# EAGLE design Wash_Hand (EAGLE 9.6.2)

## Sheet 1 of 2
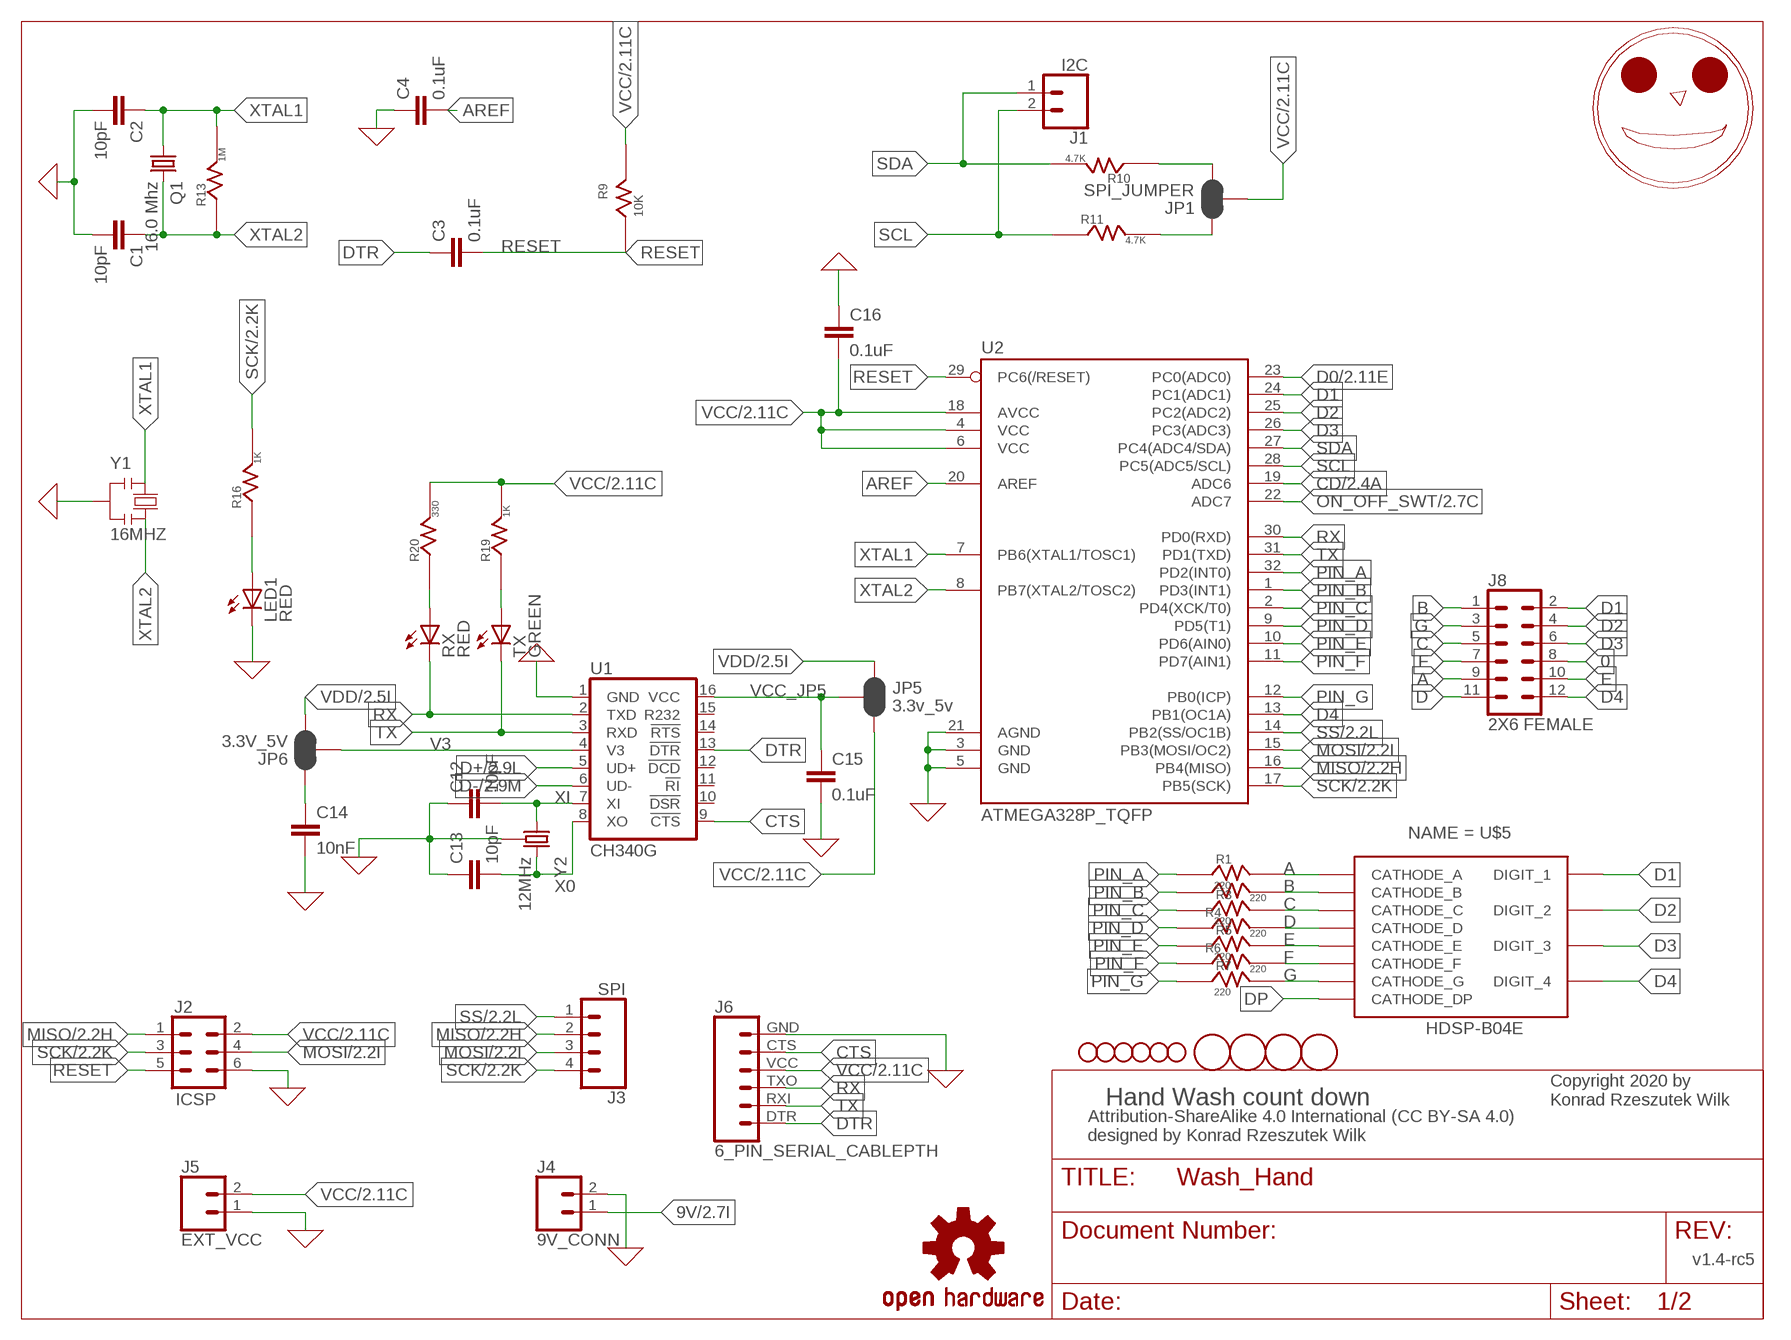
[diagram p0: schematic, sheet 1]
FRAME1 (LETTER_L): REVISION: v1.4-rc5

### Parts
C1  10pF  10UF-1206-6.3V-20%  [1206]
C2  10pF  10UF-1206-6.3V-20%  [1206]
C3  0.1uF  1.0UF-1206-50V-10%  [1206]
C4  0.1uF  1.0UF-1206-50V-10%  [1206]
C12  10pF  10UF-1206-6.3V-20%  [1206]
C13  10pF  10UF-1206-6.3V-20%  [1206]
C14  10nF  10UF-1206-6.3V-20%  [1206]
C15  0.1uF  10UF-1206-6.3V-20%  [1206]
C16  0.1uF  10UF-1206-6.3V-20%  [1206]
H1  STAND-OFF  [STAND-OFF]
H2  STAND-OFF  [STAND-OFF]
H3  STAND-OFF  [STAND-OFF]
H4  STAND-OFF  [STAND-OFF]
H5  STAND-OFF  [STAND-OFF]
H6  STAND-OFF  [STAND-OFF]
J1  I2C  CONN_02  [1X02]
J2  ICSP  CONN_03X2FEMALE  [2X3]
J3  SPI  CONN_04  [1X04]
J4  9V_CONN  CONN_02  [1X02]
J5  EXT_VCC  CONN_02  [1X02]
J6  6_PIN_SERIAL_CABLEPTH  [FTDI_BASIC]
J8  2X6 FEMALE  CONN_06X2PTH_FEMALE  [2X6]
JP1  SPI_JUMPER  JUMPER-SMT_3_2-NC_PASTE_SILK  [SMT-JUMPER_3_2-NC_PASTE_SILK]
JP5  3.3v_5v  JUMPER-SMT_3_2-NC_PASTE_SILK  [SMT-JUMPER_3_2-NC_PASTE_SILK]
JP6  3.3V_5V  JUMPER-SMT_3_2-NC_PASTE_SILK  [SMT-JUMPER_3_2-NC_PASTE_SILK]
LED1  RED  LEDSMT1206  [1206]
LOGO1  OSHW-LOGOM  [OSHW-LOGO-M]
LOGO2  HAPPY_FACE_LOGO  [HAPPY_FACE_LOGO]
Q1  16.0 Mhz  CRYSTALHC49S  [HC49/S]
R1  220  RESISTORR1206  [1206]
R2  220  RESISTORR1206  [1206]
R3  220  RESISTORR1206  [1206]
R4  220  RESISTORR1206  [1206]
R5  220  RESISTORR1206  [1206]
R6  220  RESISTORR1206  [1206]
R7  220  RESISTORR1206  [1206]
R9  10K  RESISTORR1206  [1206]
R10  4.7K  RESISTORR1206  [1206]
R11  4.7K  RESISTORR1206  [1206]
R13  1M  RESISTORR1206  [1206]
R16  1K  RESISTORR1206  [1206]
R19  1K  RESISTORR1206  [1206]
R20  330  RESISTORR1206  [1206]
RX  RED  LEDSMT1206  [1206]
TX  GREEN  LEDSMT1206  [1206]
U1  CH340G  CH340GSMD  [SO016]
U2  ATMEGA328P_TQFP  [TQFP32-08]
U$5  HDSP-B04E  [HDSP-B0XE]
U$7  FIDUCIAL  [FIDUCIAL_1MM]
U$8  FIDUCIAL  [FIDUCIAL_1MM]
U$9  FIDUCIAL  [FIDUCIAL_1MM]
U$10  FIDUCIAL  [FIDUCIAL_1MM]
Y1  16MHZ  RESONATORMU  [RESONATOR]
Y2  12MHz  CRYSTAL-GROUNDED3.2X2.5  [CRYSTAL-SMD-3.2X2.5]

### Nets
0: C1.2 C2.2 C4.1 C12.1 C13.1 C14.2 C15.2 C16.1 J2.6 J4.2 J5.1 J6.GND J8.8 LED1.C U1.1(GND) U2.3(GND) U2.5(GND) U2.21(AGND) Y1.2 Y2.2(GND) Y2.4(GND) ; supply symbol labelled GND ; also sheet 2
9V: J4.1 ; also sheet 2
A: J8.9 R1.2(R_2) U$5.PIN$11(CATHODE_A)
AREF: C4.2 U2.20(AREF)
B: J8.1 R2.2(R_2) U$5.PIN$7(CATHODE_B)
C: J8.5 R3.2(R_2) U$5.PIN$4(CATHODE_C)
CD: U2.19(ADC6) ; also sheet 2
CTS: J6.CTS U1.9(!CTS)
D: J8.11 R4.2(R_2) U$5.PIN$2(CATHODE_D)
D0: U2.23(PC0(ADC0)) ; also sheet 2
D1: J8.2 U2.24(PC1(ADC1)) U$5.PIN12(DIGIT_1)
D2: J8.4 U2.25(PC2(ADC2)) U$5.PIN$9(DIGIT_2)
D3: J8.6 U2.26(PC3(ADC3)) U$5.PIN$8(DIGIT_3)
D4: J8.12 U2.13(PB1(OC1A)) U$5.PIN$6(DIGIT_4)
D+: U1.5(UD+) ; also sheet 2
D-: U1.6(UD-) ; also sheet 2
DP: U$5.PIN$3(CATHODE_DP)
DTR: C3.1 J6.DTR U1.13(!DTR)
E: J8.10 R5.2(R_2) U$5.PIN$1(CATHODE_E)
F: J8.7 R6.2(R_2) U$5.PIN$10(CATHODE_F)
G: J8.3 R7.2(R_2) U$5.PIN$5(CATHODE_G)
MISO: J2.1 J3.2 U2.16(PB4(MISO)) ; also sheet 2
MOSI: J2.4 J3.3 U2.15(PB3(MOSI/OC2)) ; also sheet 2
N$5: JP1.3 R10.1(R_1)
N$6: JP1.1 R11.2(R_2)
N$7: LED1.A R16.1(R_1)
N$8: R19.1(R_1) TX.A
N$12: R20.1(R_1) RX.A
N$17: C14.1 JP6.1
ON_OFF_SWT: U2.22(ADC7) ; also sheet 2
PIN_A: R1.1(R_1) U2.32(PD2(INT0))
PIN_B: R2.1(R_1) U2.1(PD3(INT1))
PIN_C: R3.1(R_1) U2.2(PD4(XCK/T0))
PIN_D: R4.1(R_1) U2.9(PD5(T1))
PIN_E: R5.1(R_1) U2.10(PD6(AIN0))
PIN_F: R6.1(R_1) U2.11(PD7(AIN1))
PIN_G: R7.1(R_1) U2.12(PB0(ICP))
RESET: C3.2 J2.5 R9.1(R_1) U2.29(PC6(/RESET))
RX: J6.TXO RX.C U1.2(TXD) U2.30(PD0(RXD))
SCK: J2.3 J3.4 R16.2(R_2) U2.17(PB5(SCK)) ; also sheet 2
SCL: J1.2 R11.1(R_1) U2.28(PC5(ADC5/SCL))
SDA: J1.1 R10.2(R_2) U2.27(PC4(ADC4/SDA))
SS: J3.1 U2.14(PB2(SS/OC1B)) ; also sheet 2
TX: J6.RXI TX.C U1.3(RXD) U2.31(PD1(TXD))
V3: JP6.2 U1.4(V3)
VCC: C16.2 J2.2 J5.2 J6.VCC JP1.2 JP5.3 R9.2(R_2) R19.2(R_2) R20.2(R_2) U2.4(VCC) U2.6(VCC) U2.18(AVCC) ; also sheet 2
VCC_JP5: C15.1 JP5.2 U1.16(VCC)
VDD: JP5.1 JP6.3 ; also sheet 2
X0: C13.2 U1.8(XO) Y2.3
XI: C12.2 U1.7(XI) Y2.1
XTAL1: C2.1 Q1.1 R13.2(R_2) U2.7(PB6(XTAL1/TOSC1)) Y1.1
XTAL2: C1.1 Q1.2 R13.1(R_1) U2.8(PB7(XTAL2/TOSC2)) Y1.3
Unconnected: U1.10(!DSR) U1.11(!RI) U1.12(!DCD) U1.14(!RTS) U1.15(R232)

### Notes on the sheet
- Hand Wash count down
- Copyright 2020 by
  Konrad Rzeszutek Wilk
- Attribution-ShareAlike 4.0 International (CC BY-SA 4.0) 
  designed by Konrad Rzeszutek Wilk

## Sheet 2 of 2
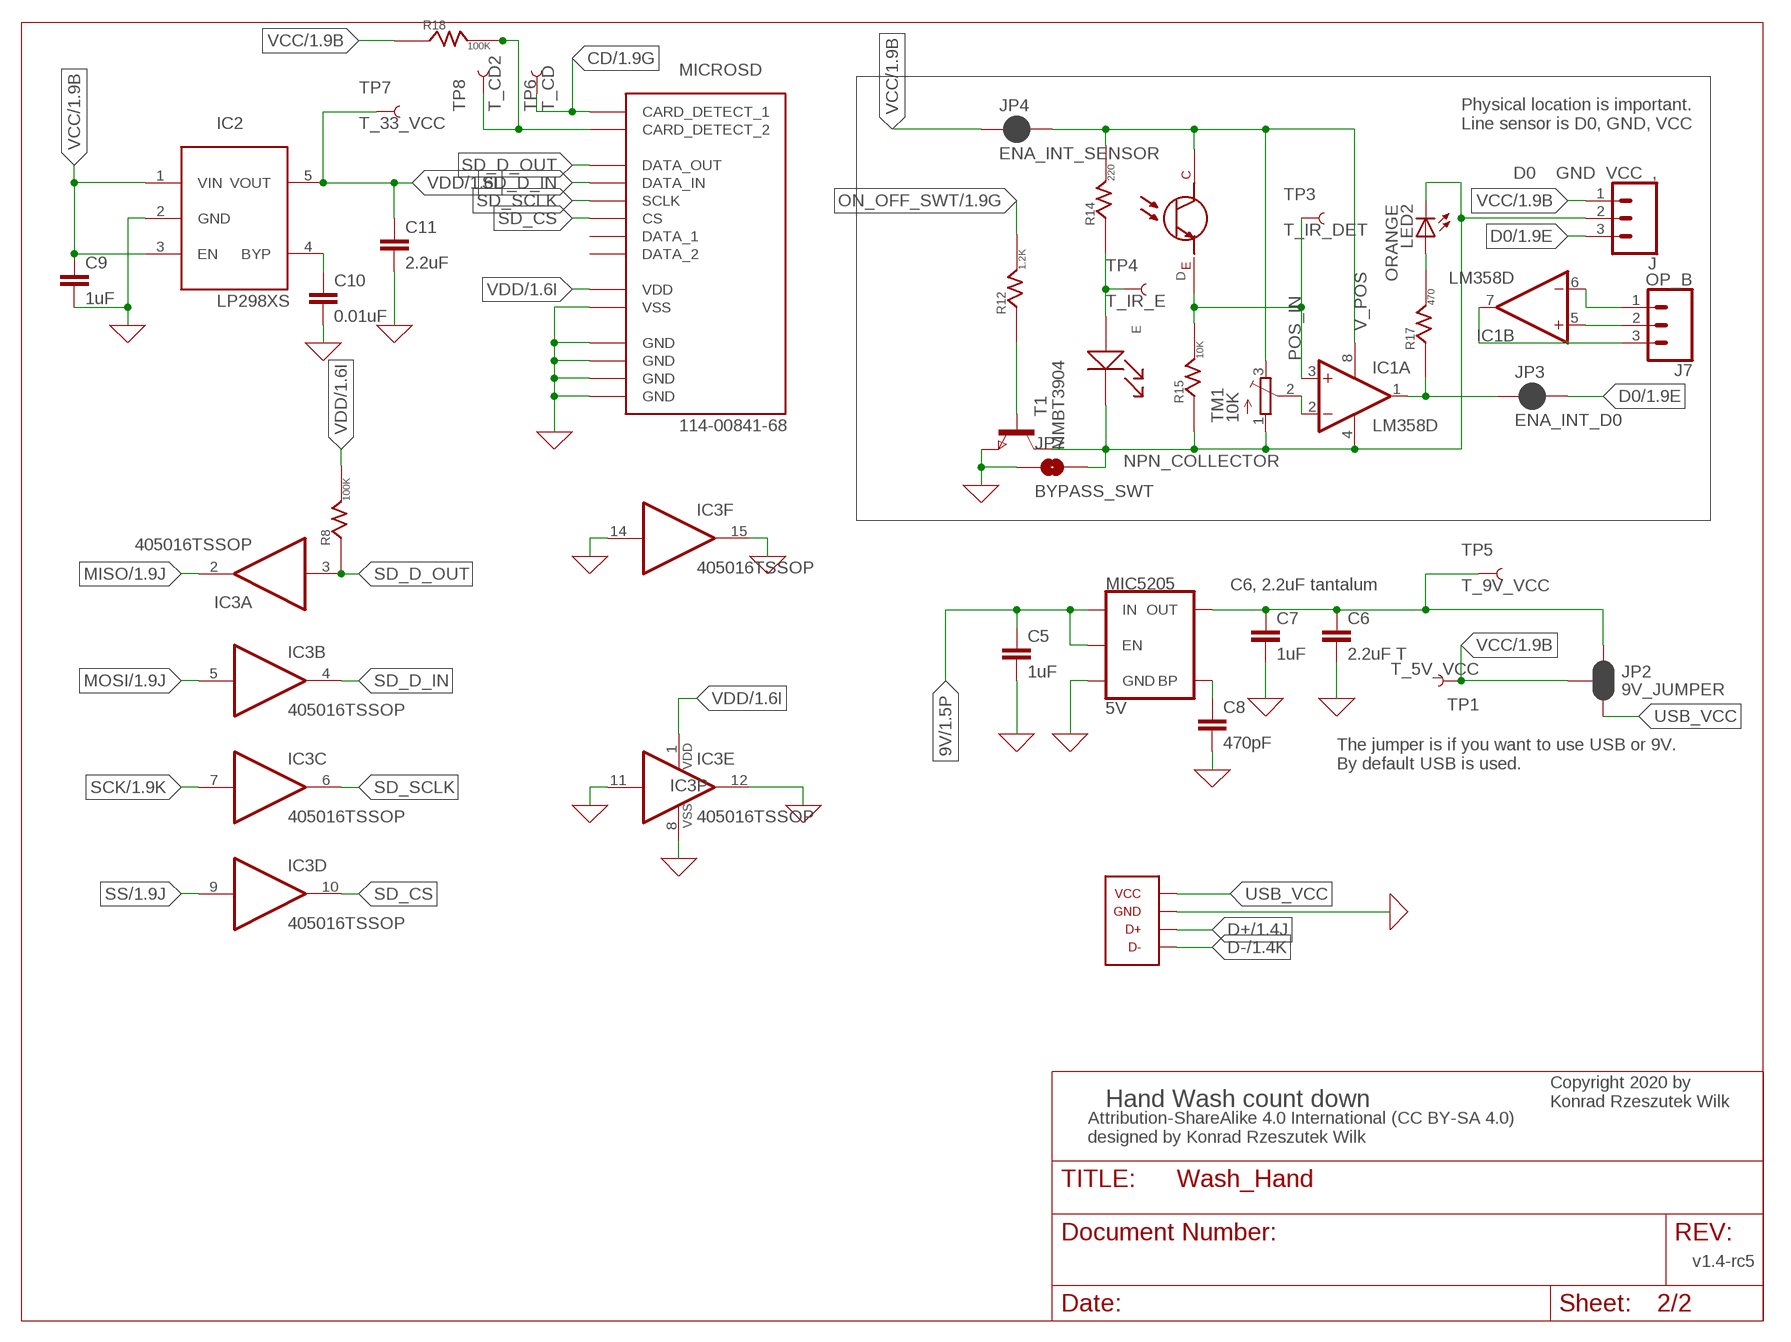
[diagram p1: schematic, sheet 2]
FRAME2 (LETTER_L): REVISION: v1.4-rc5

### Parts
C5  1uF  1.0UF-1206-50V-10%  [1206]
C6  2.2uF T  1.0UF-1206-50V-10%  [1206]
C7  1uF  1.0UF-1206-50V-10%  [1206]
C8  470pF  1.0UF-1206-50V-10%  [1206]
C9  1uF  1.0UF-1206-50V-10%  [1206]
C10  0.01uF  1.0UF-1206-50V-10%  [1206]
C11  2.2uF  1.0UF-1206-50V-10%  [1206]
D  LTR-301  [LTR-301]
E  LTE-302  [LTE-302]
IC1  LM358D  [SO08]
IC2  LP298XS  [SOT23-5L]
IC3  405016TSSOP  [TSSOP16]
J  D0 GND VCC ,  CONN_03  [1X03]
J7  OP_B  CONN_03  [1X03]
JP2  9V_JUMPER  JUMPER-SMT_3_2-NC_PASTE_SILK  [SMT-JUMPER_3_2-NC_PASTE_SILK]
JP3  ENA_INT_D0  JUMPER-SMT_2_NC_PASTE_SILK  [SMT-JUMPER_2_NC_PASTE_SILK]
JP4  ENA_INT_SENSOR  JUMPER-SMT_2_NC_PASTE_SILK  [SMT-JUMPER_2_NC_PASTE_SILK]
JP7  BYPASS_SWT  JUMPER-SMT_2_NO_SILK  [SMT-JUMPER_2_NO_SILK]
LED2  ORANGE  LEDSMT1206  [1206]
MIC5205  5V  V_REG_MIC52055V  [SOT23-5]
MICROSD  114-00841-68  [114-00841-68]
R8  100K  RESISTORR1206  [1206]
R12  1.2K  RESISTORR1206  [1206]
R14  220  RESISTORR1206  [1206]
R15  10K  RESISTORR1206  [1206]
R17  470  RESISTORR1206  [1206]
R18  100K  RESISTORR1206  [1206]
T1  MMBT3904  NPNSOT23  [SOT-23]
TM1  10K  TRIMPOTTC33X  [TC33X]
TP1  T_5V_VCC  TEST-POINT3X4  [PAD.03X.04]
TP3  T_IR_DET  TEST-POINT3X4  [PAD.03X.04]
TP4  T_IR_E  TEST-POINT3X4  [PAD.03X.04]
TP5  T_9V_VCC  TEST-POINT3X4  [PAD.03X.04]
TP6  T_CD  TEST-POINT3X4  [PAD.03X.04]
TP7  T_33_VCC  TEST-POINT3X4  [PAD.03X.04]
TP8  T_CD2  TEST-POINT3X4  [PAD.03X.04]
U$4  USB_MICROB_10118194_AMPHENOL  [USB_MICROB_10118194_AMPHENOL]

### Nets
0: C5.2 C6.2 C7.2 C8.2 C9.2 C10.2 C11.2 IC2.2(GND) IC3.8(P:VSS) IC3.11(E:I) IC3.12(E:O) IC3.14(F:I) IC3.15(F:O) JP7.1 MIC5205.2(GND) MICROSD.GND$1(GND) MICROSD.GND$2(GND) MICROSD.GND$3(GND) MICROSD.GND$4(GND) MICROSD.VSS T1.2(E) U$4.5(GND) ; supply symbol labelled GND ; also sheet 1
9V: C5.1 MIC5205.1(IN) MIC5205.3(EN) ; also sheet 1
CD: MICROSD.CD_SW_1(CARD_DETECT_1) TP6.P$1 ; also sheet 1
D0: IC1.1(A:OUT) J.3 JP3.1 JP3.2 R17.1(R_1) ; also sheet 1
D+: U$4.3(D+) ; also sheet 1
D-: U$4.2(D-) ; also sheet 1
MISO: IC3.2(A:O) ; also sheet 1
MOSI: IC3.5(B:I) ; also sheet 1
N$1: IC1.7(B:OUT) J7.3
N$2: MICROSD.CD_SW_2(CARD_DETECT_2) R18.2(R_2) TP8.P$1
N$9: IC1.5(B:+IN) J7.2
N$10: C6.1 C7.1 JP2.1 MIC5205.5(OUT) TP5.P$1
N$11: E.A(A$1) R14.1(R_1) TP4.P$1
N$13: C10.1 IC2.4(BYP)
N$14: IC1.6(B:-IN) J7.1
N$15: LED2.A R17.2(R_2)
N$16: R12.1(R_1) T1.3(B)
N$18: C8.1 MIC5205.4(BP)
NEG_IN: IC1.2(A:-IN) TM1.2(S)
NPN_COLLECTOR: E.C(K$1) IC1.4(P:V-) J.2 JP7.2 LED2.C R15.1(R_1) T1.1(C) TM1.1(A)
ON_OFF_SWT: R12.2(R_2) ; also sheet 1
POS_IN: D.E(E$1) IC1.3(A:+IN) R15.2(R_2) TP3.P$1
SCK: IC3.7(C:I) ; also sheet 1
SD_CS: IC3.10(D:O) MICROSD.CS
SD_D_IN: IC3.4(B:O) MICROSD.DATA_IN
SD_D_OUT: IC3.3(A:I) MICROSD.DATA_OUT R8.1(R_1)
SD_SCLK: IC3.6(C:O) MICROSD.SCLK
SS: IC3.9(D:I) ; also sheet 1
USB_VCC: JP2.3 U$4.1(VCC)
V_POS: D.C(C$1) IC1.8(P:V+) JP4.2 R14.2(R_2) TM1.3(E)
VCC: C9.1 IC2.1(VIN) IC2.3(EN) J.1 JP2.2 JP4.1 R18.1(R_1) TP1.P$1 ; also sheet 1
VDD: C11.1 IC2.5(VOUT) IC3.1(P:VDD) MICROSD.VDD R8.2(R_2) TP7.P$1 ; also sheet 1
Unconnected: MICROSD.DATA_1 MICROSD.DATA_2

### Notes on the sheet
- Physical location is important.
  Line sensor is D0, GND, VCC
- C6, 2.2uF tantalum
- The jumper is if you want to use USB or 9V.
  By default USB is used.
- Hand Wash count down
- Copyright 2020 by
  Konrad Rzeszutek Wilk
- Attribution-ShareAlike 4.0 International (CC BY-SA 4.0) 
  designed by Konrad Rzeszutek Wilk

## Library data of the parts
C1 C2 C12-C16 = SparkFun-Capacitors:10UF: 10.0µF ceramic capacitors A capacitor is a passive two-terminal electrical component used to store electrical energy temporarily in an electric field.; PROD_ID: CAP-10057; VALUE: 10uF
C3-C11 = SparkFun-Capacitors:1.0UF: 1µF ceramic capacitors A capacitor is a passive two-terminal electrical component used to store electrical energy temporarily in an electric field.; PROD_ID: CAP-09822; VALUE: 1.0uF
D = darnok_sensors:LTR-301
E = darnok_sensors:LTE-302
H1-H6 = SparkFun-Hardware:STAND-OFF: Stand Off Drill holes for mechanically mounting via screws, standoffs, etc. Note: Use the keepout ring to avoid running the screw head into surrounding components. Variant Overviews STAND-OFF - Mechanical footprint for a #4 phillips button head screw. STAND-OFF-TIGHT - Mechanical footprint for a #4 phillips button head screw, Example SparkFun Products Screw - Phillips Head (1/4", 4-40, 10 pack) <https://www.sparkfun.com/products/10453> (PRT-10453) Screw - Phillips Head (1/2", 4-40, 10 pack) <https://www.sparkfun.com/products/10452> (PRT-10452) Screw - Phillips Head (3/4", 4-40, 10 pack) <https://www.sparkfun.com/products/10451> (PRT-10451) Screw - Phillips Head (1", 4-40, 10 pack) <https://www.sparkfun.com/products/10450> (PRT-10450)
IC1 = linear:LM358: OP AMP also LM158; LM258; LM2904 Source: http://cache.national.com/ds/LM/LM158.pdf
IC2 = adafruit:LP298X
IC3 = darnok_4050:4050: Hex non-inverting BUFFER aka CD74HC4050PWR
J J7 = SparkFun-Connectors:CONN_03: Multi connection point. Often used as Generic Header-pin footprint for 0.1 inch spaced/style header connections On any of the 0.1 inch spaced packages, you can populate with these: Break Away Headers - Straight <https://www.sparkfun.com/products/116> (PRT-00116) Break Away Male Headers - Right Angle <https://www.sparkfun.com/products/553> (PRT-00553) Female Headers <https://www.sparkfun.com/products/115> (PRT-00115) Break Away Headers - Machine Pin <https://www.sparkfun.com/products/117> (PRT-00117) Break Away Female Headers - Swiss Machine Pin <https://www.sparkfun.com/products/743> (PRT-00743) Stackable Header - 3 Pin (Female, 0.1") <https://www.sparkfun.com/products/13875> (PRT-13875) For SCREWTERMINALS and SPRING TERMINALS visit here: Screw Terimnals on SparkFun.com <https://www.sparkfun.com/search/results?term=Screw+Terminals> (5mm/3.5mm/2.54mm spacing) This device is also useful as a general connection point to wire up your design to another part of your project. Our various solder wires solder well into these plated through hole pads. Hook-Up Wire - Assortment (Stranded, 22 AWG) <https://www.sparkfun.com/products/11375> (PRT-11375) Hook-Up Wire - Assortment (Solid Core, 22 AWG) <https://www.sparkfun.com/products/11367> (PRT-11367) View the entire wire category on our website here <https://www.sparkfun.com/categories/141> Special notes: Molex polarized connector foot print use with SKU : PRT-08232 with associated crimp pins and housings.
J1 J4 J5 = SparkFun-Connectors:CONN_02: Multi connection point. Often used as Generic Header-pin footprint for 0.1 inch spaced/style header connections On any of the 0.1 inch spaced packages, you can populate with these: Break Away Headers - Straight <https://www.sparkfun.com/products/116> (PRT-00116) Break Away Male Headers - Right Angle <https://www.sparkfun.com/products/553> (PRT-00553) Female Headers <https://www.sparkfun.com/products/115> (PRT-00115) Break Away Headers - Machine Pin <https://www.sparkfun.com/products/117> (PRT-00117) Break Away Female Headers - Swiss Machine Pin <https://www.sparkfun.com/products/743> (PRT-00743) For SCREWTERMINALS and SPRING TERMINALS visit here: Screw Terimnals on SparkFun.com <https://www.sparkfun.com/search/results?term=Screw+Terminals> (5mm/3.5mm/2.54mm spacing) This device is also useful as a general connection point to wire up your design to another part of your project. Our various solder wires solder well into these plated through hole pads. Hook-Up Wire - Assortment (Stranded, 22 AWG) <https://www.sparkfun.com/products/11375> (PRT-11375) Hook-Up Wire - Assortment (Solid Core, 22 AWG) <https://www.sparkfun.com/products/11367> (PRT-11367) View the entire wire category on our website here <https://www.sparkfun.com/categories/141> Special notes: Molex polarized connector foot print use with: PRT-08233 with associated crimp pins and housings. 2.54_SCREWTERM for use with PRT-10571. 3.5mm Screw Terminal footprints for PRT-08084 5mm Screw Terminal footprints for use with PRT-08432
J2 = SparkFun-Connectors:CONN_03X2: Multi connection point. Often used as Generic Header-pin footprint for 0.1 inch spaced/style header connections You can populate with any combo of single row headers, but if you'd like an exact match, check these: Header - 2x3 (Male, 0.1") <https://www.sparkfun.com/products/12807> (PRT-12807) Header - 2x3 (Female, 0.1") <https://www.sparkfun.com/products/13010> (PRT-13010) 2x3 Pin Shrouded Header <https://www.sparkfun.com/products/10877> (PRT-10877) On any of the 0.1 inch spaced packages, you can populate with these: Break Away Headers - Straight <https://www.sparkfun.com/products/116> (PRT-00116) Break Away Male Headers - Right Angle <https://www.sparkfun.com/products/553> (PRT-00553) Female Headers <https://www.sparkfun.com/products/115> (PRT-00115) Break Away Headers - Machine Pin <https://www.sparkfun.com/products/117> (PRT-00117) Break Away Female Headers - Swiss Machine Pin <https://www.sparkfun.com/products/743> (PRT-00743) Special note: the shrouded connector mates well with our 3x2 ribbon cables: Ribbon Crimp Connector - 6-pin (2x3, Female) <https://www.sparkfun.com/products/10651> (PRT-10651) Ribbon Cable - 6 wire (15ft) <https://www.sparkfun.com/products/10646> (PRT-10646); PROD_ID: CONN-11566; VALUE: FEMALE 2x3
J3 = SparkFun-Connectors:CONN_04: Multi connection point. Often used as Generic Header-pin footprint for 0.1 inch spaced/style header connections On any of the 0.1 inch spaced packages, you can populate with these: Break Away Headers - Straight <https://www.sparkfun.com/products/116> (PRT-00116) Break Away Male Headers - Right Angle <https://www.sparkfun.com/products/553> (PRT-00553) Female Headers <https://www.sparkfun.com/products/115> (PRT-00115) Break Away Headers - Machine Pin <https://www.sparkfun.com/products/117> (PRT-00117) Break Away Female Headers - Swiss Machine Pin <https://www.sparkfun.com/products/743> (PRT-00743) For SCREWTERMINALS and SPRING TERMINALS visit here: Screw Terimnals on SparkFun.com <https://www.sparkfun.com/search/results?term=Screw+Terminals> (5mm/3.5mm/2.54mm spacing) This device is also useful as a general connection point to wire up your design to another part of your project. Our various solder wires solder well into these plated through hole pads. Hook-Up Wire - Assortment (Stranded, 22 AWG) <https://www.sparkfun.com/products/11375> (PRT-11375) Hook-Up Wire - Assortment (Solid Core, 22 AWG) <https://www.sparkfun.com/products/11367> (PRT-11367) View the entire wire category on our website here <https://www.sparkfun.com/categories/141> Special notes: Molex polarized connector foot print use with SKU : PRT-08231 with associated crimp pins and housings. 1MM SMD Version SKU: PRT-10208; PROD_ID: CONN-09696
J6 = SparkFun-Connectors:6_PIN_SERIAL_CABLE: 6-pin header connection for use with the "FTDI BASIC" pinout - CABLE SIDE. Also known as "Arduino Serial Program Header". This is used on a design to provide a 6-pin connection point for serial communication usually from a USB cable (D+/D-) to these headers (RX/TX). It also has the remaining pins necessary for programming in the Arduino evironment (DTR, GND, and sometimes VCC). Note, this device has "CABLE" in the name. It is intended to be used on a design that usually lives on the end of your USB cable and prvides the converter chip (FTDI232 or FTDI231x) to commnicate serial RX/TX. The "sister" device, named "TARGET" is inteneded to be used on a design that contains a target micro-controller that you wish to program. You can populate with some of these: Female Headers <https://www.sparkfun.com/products/115> (PRT-00115) For reference (or to suit your programming needs) check out these designs: SparkFun FTDI Basic Breakout - 5V <https://www.sparkfun.com/products/9716> (DEV-09716) SparkFun FTDI Basic Breakout - 3.3V <https://www.sparkfun.com/products/9873> (DEV-09873) SparkFun FTDI SmartBasic <https://www.sparkfun.com/products/12935> (DEV-12935) SparkFun Beefy 3 - FTDI Basic Breakout <https://www.sparkfun.com/products/13746> (DEV-13746)
J8 = SparkFun-Connectors:CONN_06X2: Multi connection point. Often used as Generic Header-pin footprint for 0.1 inch spaced/style header connections On any of the 0.1 inch spaced packages, you can populate with these: Break Away Headers - Straight <https://www.sparkfun.com/products/116> (PRT-00116) Break Away Male Headers - Right Angle <https://www.sparkfun.com/products/553> (PRT-00553) Female Headers <https://www.sparkfun.com/products/115> (PRT-00115) Break Away Headers - Machine Pin <https://www.sparkfun.com/products/117> (PRT-00117) Break Away Female Headers - Swiss Machine Pin <https://www.sparkfun.com/products/743> (PRT-00743); PROD_ID: CONN-12423
JP1 JP2 JP5 JP6 = SparkFun-Jumpers:JUMPER-SMT_3_2-NC_PASTE: Normally closed solder jumper (2 of 2 connections) This jumper has an aperture in the stencil to allow solder paste to bridge both connections. Both connections are normally closed (NC). Wick off the solder to open the connection(s). Reapply solder to reclose the connection(s).
JP3 JP4 = SparkFun-Jumpers:JUMPER-SMT_2_NC_PASTE: Normally closed solder jumper This jumper has an aperture in the stencil to allow solder paste to bridge the split in the wire so it's normally closed (NC). Wick off the solder to open the connection. Reapply solder to reclose the connection.
JP7 = SparkFun-Jumpers:JUMPER-SMT_2_NO: Normally open jumper This jumper has two pads in close proximity to each other. Apply solder to close the connection. Round pads are easier to solder for beginners, but are a lot larger. SparkFun Product that uses the round pads: SparkFun EL Sequencer <https://www.sparkfun.com/products/12781>
LED1 LED2 RX TX = adafruit:LED: LED OSRAM: - CHIPLED LG R971, LG N971, LY N971, LG Q971, LY Q971, LO R971, LY R971 LH N974, LH R974 LS Q976, LO Q976, LY Q976 LO Q996 - Hyper CHIPLED LW Q18S LB Q993, LB Q99A, LB R99A - SideLED LS A670, LO A670, LY A670, LG A670, LP A670 LB A673, LV A673, LT A673, LW A673 LH A674 LY A675 LS A676, LA A676, LO A676, LY A676, LW A676 LS A679, LY A679, LG A679 - Hyper Micro SIDELED® LS Y876, LA Y876, LO Y876, LY Y876 LT Y87S - SmartLED LW L88C, LW L88S LB L89C, LB L89S, LG L890 LS L89K, LO L89K, LY L89K LS L896, LA L896, LO L896, LY L896 - TOPLED LS T670, LO T670, LY T670, LG T670, LP T670 LSG T670, LSP T670, LSY T670, LOP T670, LYG T670 LG T671, LOG T671, LSG T671 LB T673, LV T673, LT T673, LW T673 LH T674 LS T676, LA T676, LO T676, LY T676, LB T676, LH T676, LSB T676, LW T676 LB T67C, LV T67C, LT T67C, LS T67K, LO T67K, LY T67K, LW E67C LS E67B, LA E67B, LO E67B, LY E67B, LB E67C, LV E67C, LT E67C LW T67C LS T679, LY T679, LG T679 LS T770, LO T770, LY T770, LG T770, LP T770 LB T773, LV T773, LT T773, LW T773 LH T774 LS E675, LA E675, LY E675, LS T675 LS T776, LA T776, LO T776, LY T776, LB T776 LHGB T686 LT T68C, LB T68C - Hyper Mini TOPLED® LB M676 - Mini TOPLED Santana® LG M470 LS M47K, LO M47K, LY M47K Source: http://www.osram.convergy.de/
LOGO1 = SparkFun-Aesthetics:OSHW-LOGO: Open-Source Hardware (OSHW) Logo This logo indicates the piece of hardware it is found on incorporates a OSHW license and/or adheres to the definition of open source hardware found here: http://freedomdefined.org/OSHW
LOGO2 = darnok_logo:HAPPY_FACE_LOGO
MIC5205 = SparkFun-IC-Power:V_REG_MIC5205: V_REG MIC5205 Standard 3.3V, 5V, and Adjustable 150mA LDO voltage regulator in SOT-23 layout. Micrel part MIC5205. BP (by-pass) pin is used to lower output noise with 470pF cap, may be left open. On the adjustable version BP is used to set output.; PROD_ID: VREG-00823
MICROSD = darnok_microsd:114-00841-68: Amphenol MicroSD Push Pull Data sheet is available at here <https://media.digikey.com/pdf/Data%20Sheets/Amphenol%20PDFs/114-00841-68.pdf>.
Q1 = adafruit:CRYSTAL: CRYSTAL; OC_FARNELL: 1667008; OC_NEWARK: unknown
R1-R20 = darnok_common:RESISTOR
T1 = zetex:NPNSOT23: NPN TRANSISTOR; MPN: DSS20201L-7; OC_FARNELL: 1710688; OC_NEWARK: 25R4555
TM1 = adafruit:TRIMPOT: SMT trimmer potentiometer part number TC33X http://www.ladyada.net/library/eagle
TP1 TP3-TP8 = SparkFun-Connectors:TEST-POINT: SparkFun Test Points Bare copper test points for troubleshooting or In-Circuit-Testing. These are used by our Production team for verifying production board runs using pogo-pins on test beds. SparkFun Products: SparkFun LSM9DS1 Breakout <https://www.sparkfun.com/products/13284> SparkFun PSOC <https://www.sparkfun.com/products/13714> SparkFun Load Cell Amplifier <https://www.sparkfun.com/products/13879>
U1 = Serial-Basic:CH340G: A simple USB 2.0 to Serial IC.; PROD_ID: IC-13498
U2 = SparkFun-IC-Microcontroller:ATMEGA328P_TQFP: Popular 328P in QFP Storefront component: ATmega328 - TQFP <https://www.sparkfun.com/products/13448> (COM-13448) Datasheet <http://www.sparkfun.com/datasheets/Components/SMD/ATMega328.pdf> SparkFun Products SparkFun RedBoard - Programmed with Arduino <https://www.sparkfun.com/products/12757> (DEV-12757) Arduino Pro Mini 328 - 5V/16MHz <https://www.sparkfun.com/products/11113> (DEV-11113) Arduino Pro Mini 328 - 3.3V/8MHz <https://www.sparkfun.com/products/11114> (DEV-11114) SparkFun OpenLog <https://www.sparkfun.com/products/13712> (DEV-13712) SparkFun MicroView - OLED Arduino Module <https://www.sparkfun.com/products/12923> (DEV-12923) SparkFun Digital Sandbox <https://www.sparkfun.com/products/12651> (DEV-12651) SparkFun PicoBoard <https://www.sparkfun.com/products/11888> (WIG-11888) Arduino Fio <https://www.sparkfun.com/products/10116> (DEV-10116) LilyPad Arduino 328 Main Board <https://www.sparkfun.com/products/13342> (DEV-13342) SparkFun RedStick <https://www.sparkfun.com/products/13741> (DEV-13741) LilyPad MP3 <https://www.sparkfun.com/products/11013> (DEV-11013) LilyPad Arduino SimpleSnap <https://www.sparkfun.com/products/10941> (DEV-10941) SparkFun Stepoko <https://www.sparkfun.com/products/13899> (ROB-13899) SparkFun Geiger Counter <https://www.sparkfun.com/products/11345> (SEN-11345) SparkFun EL Sequencer <https://www.sparkfun.com/products/12781> (COM-12781) Arduino Pro 328 - 5V/16MHz <https://www.sparkfun.com/products/10915> (DEV-10915) CryptoCape <https://www.sparkfun.com/products/12773> (DEV-12773) SparkFun IR Thermometer Evaluation Board - MLX90614 <https://www.sparkfun.com/products/10740> (SEN-10740) SparkFun RedBot Mainboard <https://www.sparkfun.com/products/12097> (ROB-12097) Arduino Pro 328 - 3.3V/8MHz <https://www.sparkfun.com/products/10914> (DEV-10914) SparkFun Block for Intel® Edison - Arduino <https://www.sparkfun.com/products/13036> (DEV-13036) SparkFun Simon Says - Surface Mount Soldering Kit <https://www.sparkfun.com/products/10935> (KIT-10935) SparkFun 7-Segment Serial Display - Red <https://www.sparkfun.com/products/11441> (COM-11441) SparkFun 7-Segment Serial Display - White <https://www.sparkfun.com/products/11629> (COM-11629) SparkFun 7-Segment Serial Display - Yellow <https://www.sparkfun.com/products/11443> (COM-11443) SparkFun 7-Segment Serial Display - Kelly Green <https://www.sparkfun.com/products/11440> (COM-11440) SparkFun 7-Segment Serial Display - Blue <https://www.sparkfun.com/products/11442> (COM-11442) SparkFun OpenSegment Serial Display - 20mm (Blue) <https://www.sparkfun.com/products/11647> (COM-11647) SparkFun OpenSegment Serial Display - 20mm (Green) <https://www.sparkfun.com/products/11646> (COM-11646) SparkFun OpenSegment Serial Display - 20mm (White) <https://www.sparkfun.com/products/11648> (COM-11648) SparkFun OpenSegment Serial Display - 20mm (Red) <https://www.sparkfun.com/products/11644> (COM-11644) SparkFun OpenSegment Serial Display - 20mm (Yellow) <https://www.sparkfun.com/products/11645> (COM-11645) SparkFun OpenSegment Shield <https://www.sparkfun.com/products/13190> (DEV-13190); PROD_ID: IC-09069
U$4 = darnok_usb:USB_MICROB_10118194_AMPHENOL
U$5 = darnok_led:HDSP-B04E: 7 Segment LED light 0.56"
U$7-U$10 = adafruit:FIDUCIAL: For use by pick and place machines to calibrate the vision/machine, 1mm By microbuilder.eu
Y1 = darnok_common:RESONATOR
Y2 = Serial-Basic:CRYSTAL-GROUNDED: Small, 3.2x2.5mm, SMD Crystal; PROD_ID: XTAL-13518

## Board
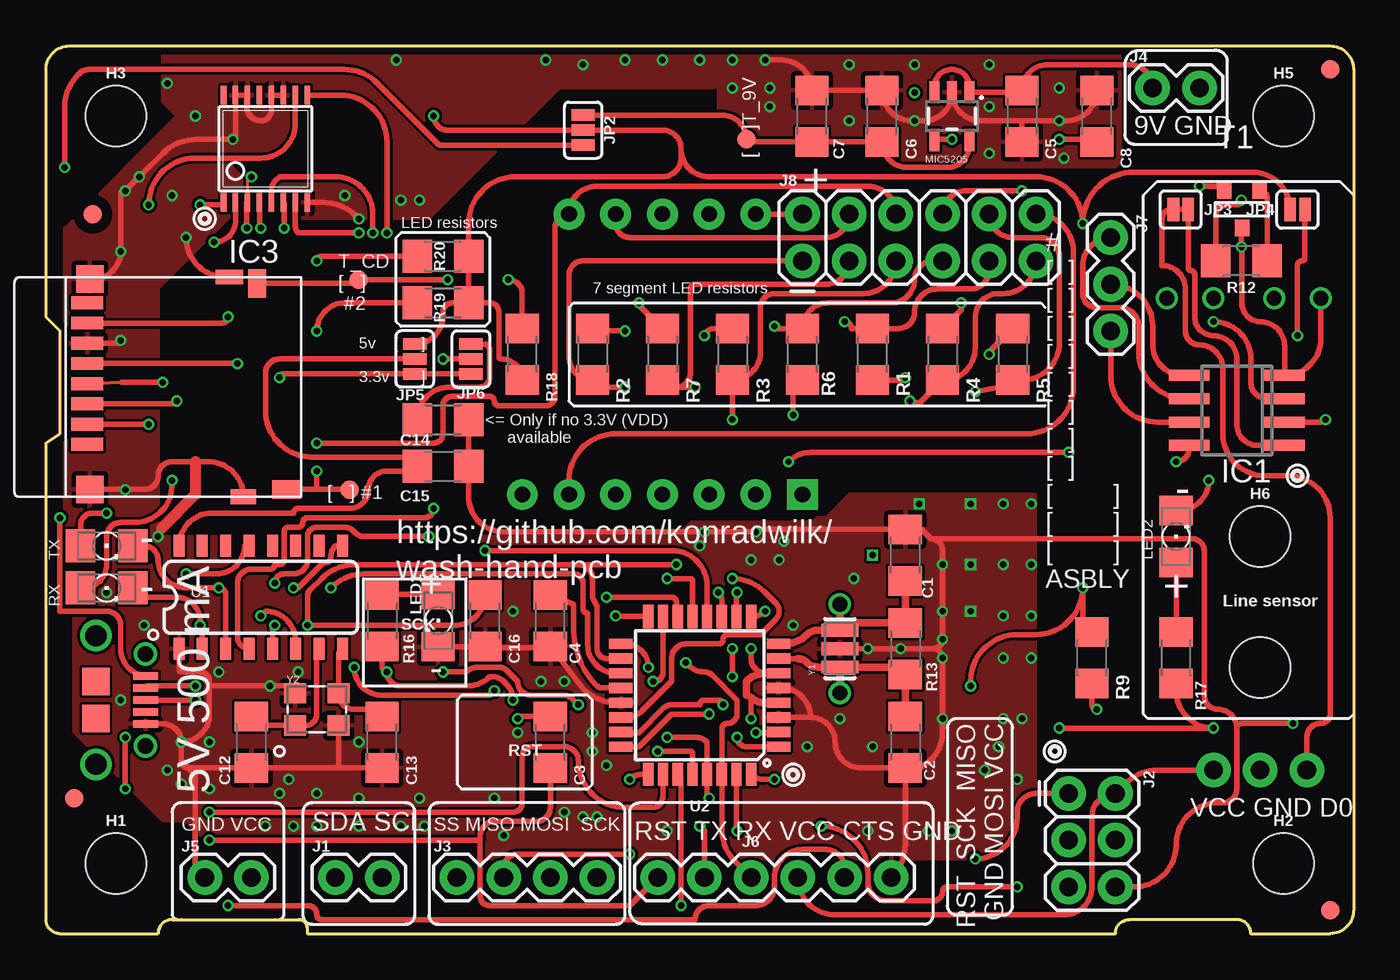
[diagram p2: board, top side]
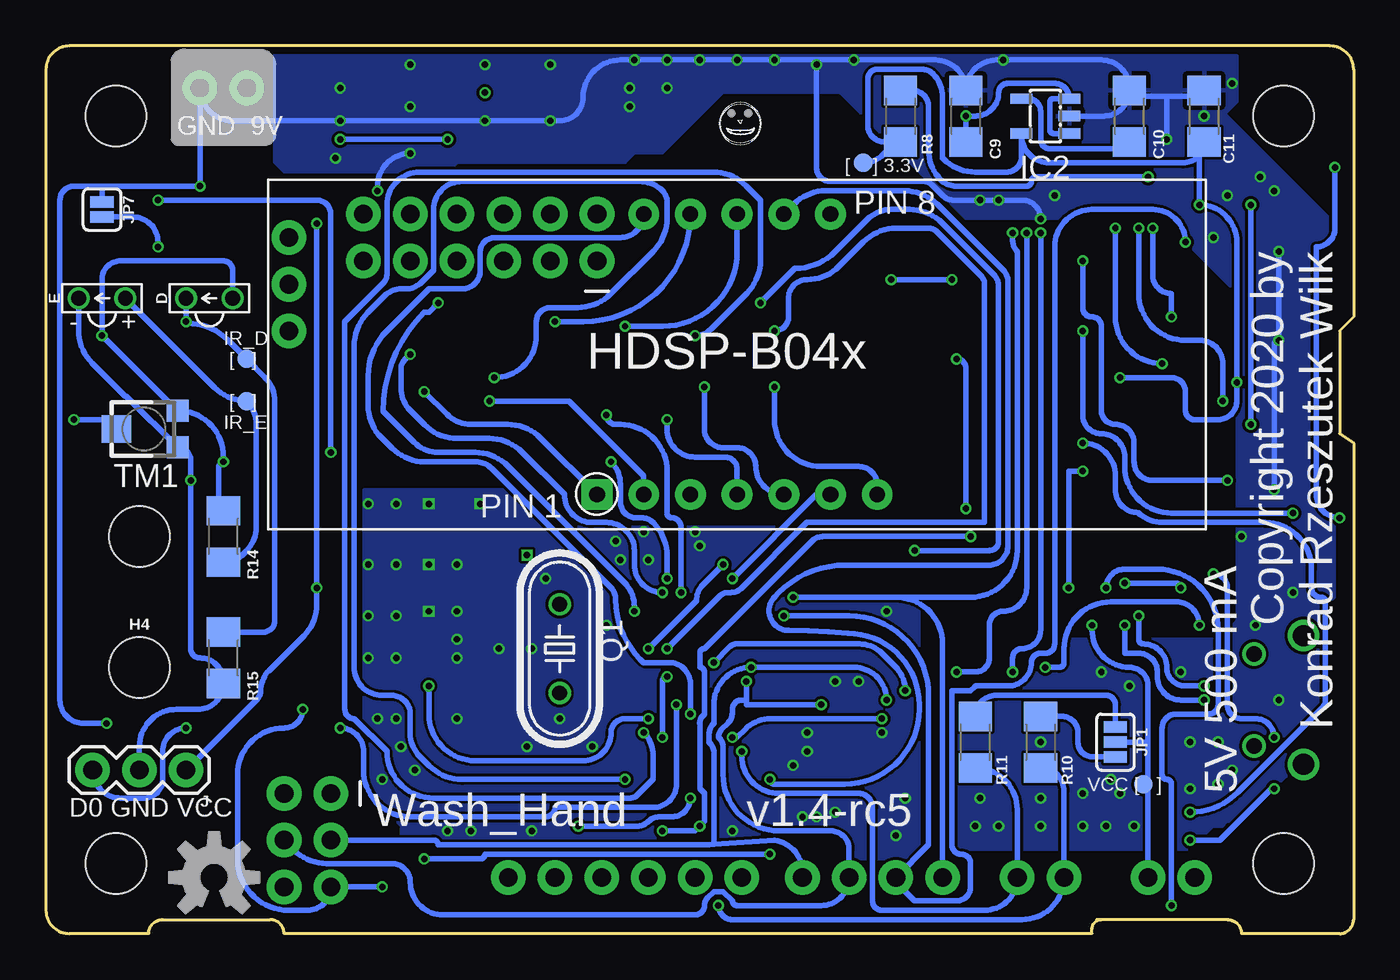
[diagram p3: board, bottom side, seen from below]

Size 71.12 x 48.26 mm. Coordinates in mm from the lower left corner, seen from the top.
Outline: 13.72,0.76 6.86,0.76 arc90 6.1,0 0.76,0 arc-90 0,0.76 0,26.67 0.76,27.18 0.76,32.77 0,33.53 0,46.99 arc-90 1.27,48.26 69.85,48.26 arc-90 71.12,46.99 71.12,1.27 arc-90 69.85,0 65.53,0 arc90 64.77,0.76 58.93,0.76 arc90 58.17,0 14.22,0 14.22,0.25 arc90 13.72,0.76
Outline: 13.72,0.76 13.97,0.76
Copper layers (1*16): Top 0.035559375mm / dielectric 1.6mm / Bottom 0.035559375mm
Design rules "oshpark-2layer": minimum track width 6mil, minimum drill 10mil, track to track 6mil, track to pad 6mil, pad to pad 6mil, via to via 6mil, smd to smd 6mil, copper to edge 15mil, drill to drill 6mil, minimum pad ring 5mil, minimum via ring 5mil, stop-mask expansion 2.5mil, vias tented up to drill 0mil, thermal gap 10mil

### Footprints (pad centres in the part's own frame; a part is rotated, then mirrored left to right if it is on the bottom)
1206 = smd 1.6 x 1.8: 1 -1.4,0; 2 1.4,0
LTR-301 = drill 0.8: C 1.27,0; E -1.27,0
LTE-302 = drill 0.8: A 1.27,0; C -1.27,0
STAND-OFF = hole 3.302: 0,0
SO08 = smd 0.6 x 2.2: 1 -1.905,-2.6; 2 -0.635,-2.6; 3 0.635,-2.6; 4 1.905,-2.6; 5 1.905,2.6; 6 0.635,2.6; 7 -0.635,2.6; 8 -1.905,2.6
SOT23-5L = smd 0.55 x 1.2: 1 -0.95,-1.3; 2 0,-1.3; 3 0.95,-1.3; 4 0.95,1.3; 5 -0.95,1.3
TSSOP16 = smd 0.305 x 0.991: 1 -2.275,-2.918; 2 -1.625,-2.918; 3 -0.975,-2.918; 4 -0.325,-2.918; 5 0.325,-2.918; 6 0.975,-2.918; 7 1.625,-2.918; 8 2.275,-2.918; 9 2.275,2.918; 10 1.625,2.918; 11 0.975,2.918; 12 0.325,2.918; 13 -0.325,2.918; 14 -0.975,2.918; 15 -1.625,2.918; 16 -2.275,2.918
1X03 = drill 1.016 pad 1.88: 1 0,0; 2 2.54,0; 3 5.08,0
1X02 = drill 1.016 pad 1.88: 1 0,0; 2 2.54,0
2X3 = drill 1.016 pad 1.88: 1 0,0; 2 0,2.54; 3 2.54,0; 4 2.54,2.54; 5 5.08,0; 6 5.08,2.54
1X04 = drill 1.016 pad 1.88: 1 0,0; 2 2.54,0; 3 5.08,0; 4 7.62,0
FTDI_BASIC = drill 1.016 pad 1.88: CTS 10.16,0; DTR 0,0; GND 12.7,0; RXI 2.54,0; TXO 5.08,0; VCC 7.62,0
2X6 = drill 1.016 pad 1.88: 1 0,0; 2 0,2.54; 3 2.54,0; 4 2.54,2.54; 5 5.08,0; 6 5.08,2.54; 7 7.62,0; 8 7.62,2.54; 9 10.16,0; 10 10.16,2.54; 11 12.7,0; 12 12.7,2.54
SMT-JUMPER_3_2-NC_PASTE_SILK = smd 0.635 x 1.27: 1 -0.813,0; 2 0,0; 3 0.813,0
SMT-JUMPER_2_NC_PASTE_SILK = smd 0.635 x 1.27: 1 -0.406,0; 2 0.406,0
SMT-JUMPER_2_NO_SILK = smd 0.635 x 1.27: 1 -0.406,0; 2 0.406,0
1206' = smd 1.6 x 1.803: A -1.422,0; C 1.422,0
SOT23-5 = smd 0.55 x 1.2: 1 -0.95,-1.3; 2 0,-1.3; 3 0.95,-1.3; 4 0.95,1.3; 5 -0.95,1.3
114-00841-68 = smd 1 x 1.55: CD_SW_1 5.57,4.96 | smd 1.55 x 1: CD_SW_2 -5.63,3.36 | smd 0.7 x 1.75: CS 2.02,-5.89; DATA_1 -4.58,-5.89; DATA_2 3.12,-5.89; DATA_IN 0.92,-5.89; DATA_OUT -3.48,-5.89; SCLK -1.28,-5.89; VDD -0.18,-5.89; VSS -2.38,-5.89 | smd 0.8 x 1.4: GND$1 5.97,2.61 | smd 1.5 x 1.5: GND$2 5.57,-5.74; GND$3 -5.88,-5.74 | smd 0.8 x 1.5: GND$4 -5.98,1.86
HC49/S = drill 0.813: 1 -2.413,0; 2 2.413,0
SOT-23 = smd 0.787 x 0.889: 1 0.025,-1.016; 2 -0.94,1.016; 3 0.991,1.016
TC33X = smd 1.2 x 1.2: 1 -1,-1.825; 3 1,-1.825 | smd 1.5 x 1.6: 2 0,1.5
PAD.03X.04 = smd 1.016 x 1.016: P$1 0,0
SO016 = smd 0.6 x 1.2: 1 -4.445,-2.8; 2 -3.175,-2.8; 3 -1.905,-2.8; 4 -0.635,-2.8; 5 0.635,-2.8; 6 1.905,-2.8; 7 3.175,-2.8; 8 4.445,-2.8; 9 4.445,2.8; 10 3.175,2.8; 11 1.905,2.8; 12 0.635,2.8; 13 -0.635,2.8; 14 -1.905,2.8; 15 -3.175,2.8; 16 -4.445,2.8
TQFP32-08 = smd 1.27 x 0.559: 1 -4.293,2.8; 2 -4.293,2; 3 -4.293,1.2; 4 -4.293,0.4; 5 -4.293,-0.4; 6 -4.293,-1.2; 7 -4.293,-2; 8 -4.293,-2.8; 17 4.293,-2.8; 18 4.293,-2; 19 4.293,-1.2; 20 4.293,-0.4; 21 4.293,0.4; 22 4.293,1.2; 23 4.293,2; 24 4.293,2.8 | smd 0.559 x 1.27: 9 -2.8,-4.293; 10 -2,-4.293; 11 -1.2,-4.293; 12 -0.4,-4.293; 13 0.4,-4.293; 14 1.2,-4.293; 15 2,-4.293; 16 2.8,-4.293; 25 2.8,4.293; 26 2,4.293; 27 1.2,4.293; 28 0.4,4.293; 29 -0.4,4.293; 30 -1.2,4.293; 31 -2,4.293; 32 -2.8,4.293
USB_MICROB_10118194_AMPHENOL = smd 0.4 x 1.35: 1 -1.3,4.15; 2 -0.65,4.15; 3 0,4.15; 4 0.65,4.15; 5 1.3,4.15 | smd 1.5 x 1.5: P$1 -1,1.45; P$2 1,1.45 | drill 0.85 pad 1.25: P$8 -2.5,4.15; P$9 2.5,4.15 | drill 1.15 pad 1.55: P$10 -3.5,1.45; P$11 3.5,1.45
HDSP-B0XE = drill 0.85 pad 1.676: PIN12 -5.08,7.62; PIN$2 -5.08,-7.62; PIN$3 -2.54,-7.62; PIN$4 0,-7.62; PIN$5 2.54,-7.62; PIN$6 5.08,-7.62; PIN$7 7.62,-7.62; PIN$8 5.08,7.62; PIN$9 2.54,7.62; PIN$10 0,7.62; PIN$11 -2.54,7.62 | drill 0.85 pad 1.676 square: PIN$1 -7.62,-7.62
FIDUCIAL_1MM = smd 1 x 1: 1 0,0
RESONATOR = smd 0.7 x 2: 1 -1,0; 2 0,0; 3 1,0
CRYSTAL-SMD-3.2X2.5 = smd 1.2 x 1.1: 1 -1.175,-0.875; 2 1.175,-0.875; 3 1.175,0.875; 4 -1.175,0.875

### Placement (x,y rotation side)
C1  46.74,20.57 90 top
C2  46.74,10.41 270 top
C3  27.43,10.41 90 top
C4  27.43,17.02 90 top
C5  53.09,44.45 270 top
C6  45.47,44.45 90 top
C7  41.66,44.45 90 top
C8  57.15,44.45 90 top
C9  21.08,44.45 90 bottom
C10  12.19,44.45 90 bottom
C11  8.13,44.45 90 bottom
C12  11.18,10.41 90 top
C13  18.29,10.41 90 top
C14  21.59,27.94 0 top
C15  21.59,25.4 0 top
C16  23.88,17.02 90 top
D  62.23,34.54 0 bottom
E  68.07,34.54 0 bottom
H1  3.81,3.81 0 top
H2  67.31,3.81 0 top
H3  3.81,44.45 0 top
H4  66.04,14.48 0 bottom
H5  67.31,44.45 0 top
H6  66.04,21.59 0 top
IC1  64.77,28.45 90 top
IC2  16.76,44.45 90 bottom
IC3  11.94,42.67 0 top
J  63.5,8.89 180 bottom
J1  15.75,3.05 0 top
J2  55.63,7.62 270 top
J3  22.35,3.05 0 top
J4  60.2,45.97 0 top
J5  8.64,3.05 0 top
J6  33.27,3.05 0 top
J7  57.91,37.85 270 top
J8  41.15,36.58 0 top
JP1  12.95,10.41 270 bottom
JP2  29.21,43.69 270 top
JP3  61.72,39.37 0 top
JP4  68.07,39.37 0 top
JP5  20.07,31.24 90 top
JP6  23.11,31.24 270 top
JP7  68.07,39.37 270 bottom
LED1  RED  [1206']  21.34,17.02 270 top
LED2  ORANGE  [1206']  61.47,21.59 90 top
LOGO1  61.98,3.05 0 bottom
LOGO2  33.53,44.2 0 bottom
MIC5205  49.28,44.45 180 top
MICROSD  8.13,29.72 270 top
Q1  43.18,15.49 90 bottom
R1  44.96,31.5 90 top
R2  29.72,31.5 270 top
R3  37.34,31.5 270 top
R4  48.77,31.5 270 top
R5  52.58,31.5 270 top
R6  41.15,31.5 90 top
R7  33.53,31.5 270 top
R8  24.64,44.45 270 bottom
R9  56.9,14.99 90 top
R10  17.02,10.41 270 bottom
R11  20.57,10.41 90 bottom
R12  65.02,36.58 180 top
R13  46.74,15.49 270 top
R14  61.47,21.59 90 bottom
R15  61.47,14.99 90 bottom
R16  18.29,17.02 270 top
R17  61.47,14.99 90 top
R18  25.91,31.5 90 top
R19  21.59,34.29 0 top
R20  21.59,36.83 0 top
RX  RED  [1206']  3.3,18.8 0 top
T1  65.02,39.37 0 top
TM1  65.79,27.43 90 bottom
TP1  11.43,8.13 0 bottom
TP3  60.2,31.24 180 bottom
TP4  60.2,28.96 180 bottom
TP5  38.1,43.18 0 top
TP6  16.51,24.13 0 top
TP7  26.67,41.91 180 bottom
TP8  17.02,35.56 0 top
TX  GREEN  [1206']  3.3,21.08 0 top
U1  11.68,18.29 0 top
U2  35.56,12.95 180 top
U$4  1.27,12.7 270 top
U$5  33.53,31.5 0 bottom
U$7  69.85,1.27 0 top
U$8  69.85,46.99 0 top
U$9  2.54,39.12 0 top
U$10  1.52,7.37 0 top
Y1  43.18,15.49 90 top
Y2  14.73,12.19 0 top

### Tracks (layer width: path | path; a pad name or v marks a point on that pad's centre or on a via)
0  (via drill 0.35)
  Top 0.203: 10.92,45.55 IC3.14
  Top 0.305: U2.21 31.04,12.55 arc-45 29.24,13.3 C4.1 27.44,15.53 23.96,15.53 arc-90 C16.1 23.85,15.6 LED1.C | J6.GND 45.99,3.07 arc45 46.74,4.86 46.74,8.89 | 46.74,8.89 C2.2 44.33,9.01 arc-90 42.93,10.41 arc90 41.59,11.75 | v39.12,47.5 40.01,47.5 arc-90 C7.2 C6.2 arc90 47.12,44.2 v47.24,44.2 47.75,44.2 arc90 49.28,45.72 MIC5205.2 arc90 50.83,44.2 53.09,44.2 | U2.3 41.59,11.75 | 41.59,11.75 arc90 39.99,13.35 U2.5 | Y1.2 v44.7,15.49 v46.48,15.49 48.26,15.49 | 48.26,15.49 arc-90 v48.77,14.99 v48.77,11.68 48.77,10.92 arc-90 46.74,8.89 | 48.13,21.47 47.62,21.97 C1.2 38.74,21.97 arc90 v38.61,21.84 v35.81,21.84 24.89,21.84 arc-90 22.99,23.75 C15.2 C14.2 | 48.13,21.47 arc-90 48.77,20.83 v48.77,20.07 v48.77,17.53 v48.77,16 arc-90 48.26,15.49 | v4.32,40.39 4.45,40.51 | 4.45,40.51 v5.08,41.15 6.37,42.44 arc-45 8.16,43.18 v10.16,43.18 arc90 10.31,43.33 IC3.15 IC3.14 | IC3.8 15.07,39.75 arc-45 16.87,39.01 v17.02,38.86 | 48.13,21.47 62.35,21.47 arc-90 62.99,20.83 62.99,12.95 arc90 63.75,12.19 arc-90 64.77,11.18 | 53.09,44.2 C5.2 | IC3.11 IC3.12 12.26,44.77 arc-90 11.68,44.2 arc-90 10.92,44.96 10.92,45.55 | C8.2 arc-90 55.5,44.2 v55.12,44.2 53.09,44.2 | U$4.5 6.38,11.4 arc-90 v7.37,10.41 | v7.37,10.41 7.37,9.4 | 7.37,9.4 8.13,8.64 8.13,3.56 arc90 J5.1 | 7.37,9.4 arc90 7.75,9.01 C12.1 16,9.01 | U1.1 7.24,14.35 arc90 7.37,14.22 8.38,14.22 arc-90 8.89,13.72 8.89,13.46 | 8.89,13.46 8.89,11.94 arc-90 v7.37,10.41 | Y2.4 arc90 13.16,13.46 v12.19,13.46 8.89,13.46 | C13.1 16,9.01 | Y2.2 15.91,9.11 16,9.01 | MICROSD.GND$2 5.35,24.15 arc90 6.1,24.89 arc-90 6.86,25.65 8.13,25.65 8.83,25.65 arc-90 MICROSD.GND$1
  Top 0.305: MICROSD.GND$4 9.77,35.7 arc-90 v7.62,37.85 | v6.1,21.59 arc-45 6.28,22.02 | J8.8 arc-90 50.04,40.39 v53.09,40.39 | MICROSD.VSS 3.9,32.1 arc90 v4.06,32.26 | MICROSD.GND$3 2.58,35.6 arc90 v4.06,37.08 4.06,40.13 arc-90 4.45,40.51 | v62.74,40.64 63.83,40.64 arc-90 T1.2 | J2.6 59.18,2.54 arc90 61.47,4.83 arc-90 63.75,7.11 64.01,7.11 arc90 64.77,7.87 64.77,11.18 | v67.82,11.43 65.02,11.43 arc90 64.77,11.18
  Top 0.61: 8.13,25.65 8.13,23.88 6.28,22.02
  Bottom 0.152: 8.45,45.53 C11.2
  Bottom 0.203: C10.2 12.19,45.97
  Bottom 0.305: 29.21,47.5 v27.18,47.5 22.73,47.5 arc90 C9.2 arc90 19.43,47.5 v19.05,47.5 13.72,47.5 arc90 12.19,45.97 | 29.21,47.5 v31.5,47.5 v33.53,47.5 v35.56,47.5 v37.34,47.5 v39.12,47.5 39.88,47.5 arc-90 41.91,45.47 arc90 43.18,44.2 v43.69,44.2 v47.24,44.2 v55.12,44.2 60.96,44.2 arc90 J4.2 v62.74,40.64 68.07,40.64 | 29.21,47.5 v29.21,47.24 29.21,41.66 arc-90 28.45,40.89 23.37,40.89 arc45 22.93,40.71 22.35,40.13 arc-45 21.74,39.88 v20.32,39.88 v19.3,39.88 18.03,39.88 arc90 v17.02,38.86 | 10.16,45.53 11.87,45.53 arc90 C10.2 arc90 13.59,44.45 IC2.2 | 8.45,45.53 10.16,45.53 | 10.16,45.53 v10.16,43.18 | v51.31,42.42 arc-90 53.09,40.64 v53.09,40.39 | v4.06,37.08 v4.06,32.26 arc-90 4.32,32 v4.32,24.13 | 68.07,40.64 69.6,40.64 arc-90 70.36,39.88 70.36,12.7 arc-90 69.09,11.43 v67.82,11.43 | JP7.1 68.07,40.64
  other vias: 50.29,17.53 43.94,19.3 40.64,16.76 43.18,11.68 50.29,20.07 50.29,23.37 47.5,23.37 53.59,23.37 53.59,17.27 53.59,20.07 51.82,10.16 51.05,8.89 52.83,8.38 53.09,11.68 53.59,14.99 52.07,11.68 52.07,14.99 52.07,17.27 52.07,20.07 52.07,23.37 44.96,10.16 41.4,10.16 49.28,5.59 48.01,5.59 44.7,5.59 29.72,10.92 29.72,9.91 30.48,9.14 40.13,21.34 39.88,20.32 38.35,20.32 16.26,40.13 55.12,45.97 55.37,42.16 51.31,44.96 51.31,47.24 47.24,47.24 43.69,47.24 6.6,46.23 8.13,44.45 39.37,45.97 39.37,44.96 37.34,45.97 6.86,40.13 5.33,16.76 19.3,5.84 20.57,5.84 17.02,5.84 13.46,5.84 13.21,8.38 11.94,5.84 14.73,5.84 25.65,10.92 6.6,8.89 7.37,8.13 9.4,14.22 13.72,14.22 17.02,10.41 20.32,7.37 17.02,7.37 14.73,7.62 12.7,7.62 29.21,6.35 24.38,7.37 8.89,10.41 8.89,7.87 28.19,6.6 24.89,5.33 29.97,6.35 33.78,5.59 25.4,17.53 4.06,12.7 26.92,13.72 28.19,13.72 3.3,18.54 35.56,21.08
  pour Top: 53.85,23.88 43.69,23.88 42.42,22.61 41.91,22.61 41.66,22.35 35.05,22.35 34.29,21.59 23.62,21.59 23.62,4.06 52.32,4.06 53.85,5.59
  pour Bottom: 53.85,24.13 53.85,7.87 51.82,5.84 51.82,4.06 23.62,4.06 23.62,22.1 42.16,22.1 43.69,23.62 43.69,24.13
  pour Top: 58.42,41.91 58.17,41.66 38.35,41.66 36.58,43.43 36.58,46.23 36.32,45.97 27.94,45.97 20.83,38.86 12.7,38.86 6.35,45.21 6.35,48.26 58.42,48.01
  pour Bottom: 6.35,47.75 6.35,45.21 9.4,42.16 9.4,39.37 9.91,38.86 20.83,38.86 21.08,38.86 27.94,45.72 34.29,45.72 37.59,42.42 39.12,42.42 39.62,41.91 48.77,41.91 49.28,41.4 58.17,41.4 58.67,41.91 58.67,48.01 6.6,48.01
  pour Top: 24.38,4.83 8.89,4.83 7.62,6.1 6.35,6.1 1.52,10.92 1.52,18.03 1.02,18.54 1.02,38.35 7.37,44.7 7.37,44.45 11.43,40.39 6.1,35.05 6.1,21.59 24.38,21.59
  pour Bottom: 8.64,4.83 7.62,5.84 7.11,5.84 6.86,6.1 6.1,6.1 1.27,10.92 1.02,10.92 1.27,11.18 1.27,18.03 1.02,18.29 1.02,38.61 7.11,44.7 7.37,44.7 11.43,40.64 11.43,39.88 6.6,35.05 6.35,35.05 6.35,17.02 7.37,16 24.89,16 24.89,8.64 23.62,7.37 23.62,5.08 23.11,4.57 8.64,4.57
9V
  Top 0.305: J4.1 arc90 58.93,47.24 54.48,47.24 arc90 C5.1 arc-90 52.99,45.75 MIC5205.1 50.23,46.04 arc90 49.28,46.99 arc90 48.33,46.04 MIC5205.3
A  (via drill 0.35)
  Top 0.305: v43.43,33.27 arc-90 43.81,32.9 R1.2 46.36,32.9 arc90 47.24,33.78 arc-90 48.51,35.05 49.28,35.05 50.29,35.05 arc90 51.31,36.07 J8.9
  Bottom 0.305: U$5.PIN$11 arc90 41.91,33.27 v43.43,33.27
AREF
  Top 0.305: U2.20 30.23,13.35 arc-45 29.97,13.46 29.95,13.48 arc-45 28.7,16.5 28.7,17.91 C4.2
B  (via drill 0.35)
  Top 0.305: v31.5,29.72 30.1,29.72 arc-90 R2.2 arc-90 28.45,31.37 28.45,35.81 arc-90 29.21,36.58 J8.1
  Bottom 0.305: U$5.PIN$7 25.91,24.38 arc-90 26.92,25.4 28.96,25.4 arc90 31.5,27.94 v31.5,29.72
C  (via drill 0.35)
  Top 0.305: v37.34,27.94 R3.2 arc90 38.86,31.62 38.86,34.04 arc-90 39.62,34.8 44.45,34.8 arc90 J8.5
  Bottom 0.305: U$5.PIN$4 33.53,25.23 arc-90 34.2,25.91 35.81,25.91 arc90 37.34,27.43 v37.34,27.94
CD  (via drill 0.35)
  Top 0.152: 16.49,24.15 TP6.P$1
  Top 0.305: TP6.P$1 arc90 16.49,24.15 MICROSD.CD_SW_1 14.73,24.15 v14.73,25.15 | U2.19 31.01,14.15 arc-90 29.46,15.7 29.46,17.42 arc-90 29.21,17.68 29.21,19.05 arc90 28.7,19.56 17.31,19.56 arc45 15.51,18.81 v15.49,18.8
  Bottom 0.305: v14.73,25.15 15.49,25.15 v15.49,18.8
CTS  (via drill 0.35)
  Top 0.305: J6.CTS 43.43,3.56 arc90 42.42,4.57 41.15,4.57 arc90 39.62,3.05 39.62,2.54 arc-90 38.61,1.52 36.07,1.52 arc90 35.31,0.76 14.99,0.76 arc-90 14.73,1.02 arc90 14.22,1.52 v9.91,1.52 | U1.9 15.75,21.09 arc45 15.49,20.46 15.49,20.32 arc-45 15.06,20.14 13.72,18.8 arc90 v13.46,18.8
  Bottom 0.305: v13.46,18.8 arc90 12.45,19.81 10.67,19.81 arc90 7.37,16.51 7.37,12.45 arc90 7.87,11.94 9.65,11.94 arc-90 10.41,11.18 10.41,8.64 arc-90 10.16,8.38 arc90 9.91,8.13 v9.91,1.52
D  (via drill 0.35)
  Top 0.305: v46.99,28.96 47.53,28.86 48.71,30.03 | 48.71,30.03 R4.2 | J8.11 arc-90 52.07,34.8 51.82,34.8 arc90 50.55,33.53 50.55,31.87 arc-90 48.71,30.03
  Bottom 0.305: v46.99,28.96 42.67,28.96 38.61,24.89 U$5.PIN$2
D0  (via drill 0.35)
  Top 0.152: 67.31,26.54 IC1.1 | JP3.1 61.21,39.37
  Top 0.305: U2.23 arc45 31.34,10.92 32.26,10.92 33.6,12.27 arc-45 34.04,12.45 35.56,12.45 arc-90 35.81,12.7 36.58,12.7 arc-90 v36.83,12.45 | v55.12,11.18 v63.5,11.18 arc-90 61.47,13.21 R17.1 | 67.31,26.54 65.91,26.54 arc-90 64.77,27.69 64.77,31.24 arc90 63.5,32.51 arc-90 62.48,33.53 62.48,35.81 arc90 62.23,36.07 arc-90 62.13,36.17 JP3.2 JP3.1 | J.3 68.58,10.67 arc-90 69.34,11.43 arc90 69.85,11.94 69.85,22.61 arc90 67.56,24.89 66.29,24.89 arc-90 64.01,27.18 64.01,30.73 arc90 62.74,32 arc-90 61.98,32.77 61.98,35.05 arc90 60.71,36.32 60.71,38.86 arc-90 61.21,39.37
  Bottom 0.305: J.3 arc-90 67.06,7.37 65.79,7.37 arc-90 64.77,8.38 64.77,9.91 arc90 v63.5,11.18 | v55.12,11.18 arc90 53.85,9.91 53.85,8.89 arc-90 51.31,6.35 43.94,6.35 arc-90 43.43,6.86 38.1,6.86 arc-90 36.83,8.13 v36.83,12.45
D1  (via drill 0.35)
  Top 0.305: U2.24 arc-90 U2.24 32.26,10.16 34.04,11.94 v36.07,11.94 | J8.2 U$5.PIN12
  Bottom 0.305: U$5.PIN12 arc90 39.88,37.85 46.7,37.85 arc-90 47.5,37.05 47.5,36.07 arc90 48.51,35.05 50.29,35.05 52.6,32.75 arc-45 53.59,30.34 53.59,28.7 arc-45 52.88,26.97 52.31,26.4 arc-45 50.51,25.65 47.75,25.65 arc45 46.88,25.3 40.39,18.8 arc45 40.13,18.18 40.13,18.14 arc-45 38.8,14.92 38.61,14.73 37.23,14.73 arc90 36.07,13.57 v36.07,11.94
D2  (via drill 0.35)
  Top 0.305: v31.75,8.38 arc-45 32.42,8.66 U2.25 | U$5.PIN$9 30.99,38.61 arc90 31.75,37.85 42.42,37.85 arc90 J8.4
  Bottom 0.305: U$5.PIN$9 30.44,39.67 arc45 28.7,40.39 24.42,40.39 arc45 22.62,39.64 19.05,36.07 arc45 18.8,35.45 18.8,21.08 arc90 19.84,20.04 27.63,20.04 arc-45 31.27,18.53 31.48,18.32 arc-135 30.72,16.48 arc6 27.5,16.32 arc90 23.62,12.45 23.62,12.19 arc90 27.69,8.13 31.5,8.13 arc90 v31.75,8.38
D3  (via drill 0.35)
  Top 0.305: U2.26 33.56,7.44 arc-45 33.53,7.37 arc-90 33.02,6.86 31.5,6.86 arc-90 28.96,9.4 arc90 28.19,10.16 26.42,10.16 arc90 25.91,9.65 25.91,7.11 arc-90 25.4,6.6 v8.89,6.6 | v14.73,26.67 21.08,26.67 arc90 21.59,27.18 21.59,28.7 arc-90 22.1,29.21 24.13,29.21 arc-90 24.38,28.96 arc90 24.64,28.7 27.18,28.7 arc90 27.69,29.21 27.69,38.35 arc-90 U$5.PIN$8 arc-90 29.97,40.64 44.7,40.64 arc-90 J8.6
  Bottom 0.305: v8.89,6.6 v8.88,6.6 arc-45 6.29,7.68 1.7,12.27 arc-45 1.52,12.7 1.52,18.03 arc-90 1.78,18.29 arc90 2.29,18.8 2.29,19.81 arc-90 4.83,22.35 10.41,22.35 arc45 11.71,22.89 arc90 12.95,24.13 12.95,24.89 arc-90 v14.73,26.67
D4  (via drill 0.35)
  Top 0.305: U2.13 35.16,19.2 arc90 35.05,19.3 v33.78,19.3 | J8.12 arc-90 55.88,37.08 55.88,29.72 arc-90 53.34,27.18 30.99,27.18 arc90 28.45,24.64 U$5.PIN$6
  Bottom 0.305: U$5.PIN$6 29.21,23.88 v33.78,19.3
D+  (via drill 0.35)
  Top 0.305: U1.5 12.32,16.76 v12.45,16.76 | v8.13,12.7 U$4.3
  Bottom 0.305: v12.45,16.76 12.45,15.24 11.68,15.24 arc90 10.67,14.22 10.67,13.97 arc-90 9.4,12.7 v8.13,12.7
D-  (via drill 0.35)
  Top 0.305: U1.6 13.59,15.88 arc90 11.94,17.53 v11.68,17.27 | U$4.2 arc-90 5.53,13.46 v8.13,13.46
  Bottom 0.305: v11.68,17.27 11.68,16 arc-90 11.43,15.75 arc90 10.16,14.48 arc-90 9.14,13.46 v8.13,13.46
DTR  (via drill 0.35)
  Top 0.305: J6.DTR 31.75,1.52 24.13,1.52 arc-90 23.62,2.03 23.62,5.08 | U1.13 10.8,21.09 arc-90 9.27,19.56 v7.62,19.56 | 23.62,5.08 v8.89,5.08 | v4.32,7.87 v4.32,10.67 | C3.1 27.43,6.86 arc-90 26.67,6.1 24.38,6.1 arc90 23.62,5.33 23.62,5.08
  Bottom 0.305: v4.32,7.87 4.48,7.87 7.27,5.08 v8.89,5.08 | v4.32,10.67 arc-90 5.33,11.68 6.1,11.68 arc90 6.86,12.45 6.86,18.8 arc-90 v7.62,19.56
E  (via drill 0.35)
  Top 0.305: v50.55,29.46 52.26,29.78 R5.2 53.09,30.1 arc90 55.12,32.13 55.12,36.83 arc90 54.1,37.85 52.58,37.85 arc-90 J8.10
  Bottom 0.305: v50.55,29.46 49.31,28.23 arc-45 48.01,27.69 46.01,27.69 arc45 44.21,26.94 U$5.PIN$1
F  (via drill 0.35)
  Top 0.305: v39.62,33.02 arc-90 39.75,32.9 R6.2 arc-90 42.54,34.29 45.97,34.29 arc90 47.24,35.56 arc-90 48.26,36.58 J8.7
  Bottom 0.305: U$5.PIN$10 33.53,37.08 arc90 37.59,33.02 v39.62,33.02
G  (via drill 0.35)
  Top 0.305: v35.31,29.72 34.29,29.72 | 34.29,29.72 33.91,29.72 arc-90 R7.2 | J8.3 arc-90 42.42,35.31 35.31,35.31 arc90 35.05,35.05 35.05,30.48 arc-90 34.29,29.72
  Bottom 0.305: U$5.PIN$5 arc90 32.51,25.4 arc-90 33.53,26.42 34.29,26.42 arc90 35.31,27.43 v35.31,29.72
MISO  (via drill 0.35)
  Top 0.305: J2.1 53.85,7.62 arc90 52.83,6.6 52.83,6.35 arc-90 v50.55,4.06 | v31.75,4.32 25.65,4.32 arc90 24.89,3.56 J3.2 | U2.16 31.05,17.25 arc-45 v30.99,17.27 | IC3.2 10.31,38.76 arc-90 v9.14,37.59
  Bottom 0.305: v9.14,37.59 arc-90 10.92,39.37 14.22,39.37 arc-90 16.26,37.34 16.26,15.75 arc90 16.76,15.24 17.02,15.24 arc-90 17.53,14.73 arc90 18.8,13.46 20.53,13.46 arc-45 20.61,13.43 20.83,13.21 21.84,13.21 21.84,4.83 arc-90 21.34,4.32 arc90 20.83,3.81 20.83,2.54 arc90 21.59,1.78 23.88,1.78 24.89,2.79 J3.2 23.11,4.83 23.11,12.95 arc-90 27.43,17.27 v30.99,17.27 | v31.75,4.32 47.24,4.32 arc90 47.5,4.06 v50.55,4.06
MOSI  (via drill 0.35)
  Top 0.305: IC3.5 12.26,40.45 arc-45 12.45,40.89 12.7,41.15 15.75,41.15 arc-90 17.78,39.12 v17.78,38.1 | U2.15 33.56,14.19 arc-90 33.08,13.72 v33.02,13.72 | v28.96,12.45 28.63,12.77 arc45 28.19,12.95 26.42,12.95 arc-90 25.65,13.72 25.07,14.3 arc45 24.64,14.48 23.47,14.48 arc45 22.86,14.22 v21.59,14.22
  Bottom 0.305: J2.4 57.64,4.55 arc-45 55.84,3.81 52.32,3.81 arc90 51.31,2.79 arc-90 49.53,1.02 35.81,1.02 arc-90 35.31,1.52 arc45 35.13,1.96 34.8,2.29 34.29,2.29 33.78,1.78 arc-90 33.53,1.52 28.96,1.52 arc-90 J3.3 27.43,4.57 arc-90 28.45,5.59 31.24,5.59 arc90 34.29,8.64 34.29,10.16 arc-45 34.47,10.59 34.54,10.67 arc45 34.36,11.1 34.04,11.43 arc-45 33.78,12.04 33.78,12.19 arc90 33.27,12.7 33.02,12.7 | v17.78,38.1 17.78,18.8 arc90 19.05,17.53 arc-90 19.81,16.76 19.81,14.99 arc90 20.57,14.22 v21.59,14.22 | v28.96,12.45 33.02,12.45 33.02,12.7 | v33.02,13.72 33.02,12.7
N$1
  Top 0.305: IC1.7 60.45,27.81 arc-90 57.91,30.35 J7.3
N$2  (via drill 0.35)
  Top 0.305: MICROSD.CD_SW_2 16.81,35.35 arc90 TP8.P$1 v21.84,35.56 | R18.2 25.91,34.8 arc90 v25.15,35.56
  Bottom 0.305: v25.15,35.56 v21.84,35.56
N$3  (via drill 0.35)
  other vias: 47.24,45.72
N$4  (via drill 0.35)
  other vias: 44.96,20.57
N$5
  Bottom 0.305: JP1.3 14.17,9.6 arc90 14.99,10.41 14.99,10.92 arc-90 15.88,11.81 R10.1
N$6
  Bottom 0.305: JP1.1 12.95,12.45 arc-90 13.46,12.95 19.43,12.95 arc-90 R11.2
N$7
  Top 0.305: LED1.A 18.31,18.44 R16.1
N$8  (via drill 0.35)
  Top 0.305: TX.A 1.88,22.2 arc-90 2.54,22.86 v3.3,22.86 | R19.1 16.26,34.29 arc90 v14.73,32.77
  Bottom 0.305: v3.3,22.86 9.91,22.86 arc90 12.45,25.4 12.45,25.91 arc-90 13.72,27.18 arc90 14.73,28.19 v14.73,32.77
N$9
  Top 0.305: IC1.5 61.85,30.35 arc-90 60.2,32 60.2,33.02 arc90 J7.2
N$10
  Top 0.203: TP5.P$1 38.23,43.05
  Top 0.305: TP5.P$1 arc90 36.78,44.5 JP2.1 | MIC5205.5 50.23,42.86 arc-90 49.02,41.66 46.86,41.66 arc-90 C6.1 C7.1 38.23,43.05 | 38.23,43.05 arc-90 TP5.P$1 | TP5.P$1 arc-90 38.23,43.05
N$11
  Bottom 0.305: E.A 61.93,29.67 arc-45 TP4.P$1 arc45 59.69,27.73 59.69,22.05 arc45 60.2,20.83 60.39,20.64 arc45 R14.1
N$12  (via drill 0.35)
  Top 0.305: RX.A 2.03,18.8 arc90 3.3,20.07 3.3,21.59 arc-90 4.06,22.35 4.83,22.35 arc90 6.86,24.38 v6.86,24.64 | R20.1 14.99,36.83 arc90 v14.73,36.58
  Bottom 0.305: v14.73,36.58 14.73,34.04 arc-90 14.22,33.53 arc90 13.72,33.02 13.72,28.45 arc-90 12.95,27.69 arc90 11.94,26.67 11.94,25.65 arc-90 10.92,24.64 v6.86,24.64
N$13
  Bottom 0.152: C10.1 12.38,42.86 12.57,42.67
  Bottom 0.305: IC2.4 17.71,45.4 arc90 17.02,44.7 17.02,43.18 arc-90 16.51,42.67 12.57,42.67 arc-90 12.38,42.86
N$14
  Top 0.305: IC1.6 61.98,29.08 arc-90 59.44,31.62 59.44,33.02 arc90 58.42,34.04 57.15,34.04 arc-90 56.39,34.8 56.39,36.32 arc-90 J7.1
N$15
  Top 0.305: LED2.A R17.2
N$16
  Top 0.305: R12.1 66.42,39.98 arc90 T1.3
N$17
  Top 0.305: C14.1 arc-90 21.97,29.72 23.62,29.72 arc90 24.13,30.23 24.13,31.75 arc90 23.82,32.05 JP6.1
N$18  (via drill 0.35)
  Top 0.305: MIC5205.4 arc-90 48.36,43.18 v49.28,43.18 | v55.12,43.18 57.02,43.18 arc-90 C8.1
  Bottom 0.305: v49.28,43.18 v55.12,43.18
NEG_IN  (via drill 0.35)
  Top 0.305: v69.6,27.94 arc-45 69.29,27.81 IC1.2
  Bottom 0.305: TM1.2 arc-90 67.79,27.94 v69.6,27.94
NPN_COLLECTOR  (via drill 0.35)
  Top 0.305: E.C 69.34,32.33 arc-90 IC1.4 67.37,31.94 arc90 66.04,33.27 arc-90 65.05,34.27 65.05,37.31 arc90 v65.02,37.34 65.02,38.33 arc-90 T1.1 | LED2.C 61.62,23.01 arc90 v63.25,24.64
  Bottom 0.305: E.C 69.34,32.8 arc-45 68.6,31.01 66.8,29.21 arc45 66.69,29.16 TM1.1 arc90 63.25,25.72 v63.25,24.64 63.25,15.49 arc-90 62.74,14.99 arc90 61.47,13.72 R15.1 arc90 62.86,12.19 64.01,12.19 arc-90 66.04,10.16 J.2 | JP7.2 66.4,38.96 arc90 65.02,37.59 v65.02,37.34
ON_OFF_SWT  (via drill 0.35)
  Top 0.305: U2.22 31.57,11.75 arc45 32.43,12.11 34.04,13.72 34.04,14.99 arc-90 34.8,15.75 36.58,15.75 arc90 36.83,16 arc-90 37.08,16.26 38.86,16.26 39.7,17.09 arc45 39.88,17.53 arc45 39.7,17.96 39.07,18.59 arc45 v37.34,19.3 | v55.63,26.16 41.61,26.16 arc45 v40.39,25.65 | v65.02,39.88 arc-90 64.77,39.62 64.26,39.62 arc90 63.62,38.99 R12.2
  Bottom 0.305: v37.34,19.3 37.34,20.54 arc-45 38.08,22.33 38.1,22.35 arc-45 38.71,22.61 39.01,22.61 arc45 39.62,22.86 arc45 39.88,23.47 39.88,24.43 arc-45 v40.39,25.65 | v65.02,39.88 56.39,39.88 arc90 55.63,39.12 v55.63,26.16
PIN_A  (via drill 0.35)
  Top 0.305: v39.62,8.38 39.03,8.38 arc-45 U2.32 | R1.1 46.61,30.1 arc90 v46.74,30.23
  Bottom 0.305: v39.62,8.38 48.48,8.38 arc45 50.27,9.13 50.8,9.65 arc45 51.31,10.88 51.31,11.94 arc-90 52.32,12.95 52.83,12.95 arc90 54.36,14.48 54.36,31.97 arc45 53.61,33.76 52.7,34.67 arc45 51.78,35.05 51.56,35.05 arc-45 50.7,35.41 50.04,36.07 50.04,39.37 arc90 48.51,40.89 38.82,40.89 arc45 37.59,40.39 arc45 37.34,39.77 37.34,38.9 arc45 38.08,37.1 arc90 38.1,37.08 40.4,34.78 arc45 42.2,34.04 43.69,34.04 arc-90 44.45,33.27 44.45,32.51 arc90 v46.74,30.23
PIN_B  (via drill 0.35)
  Top 0.305: R2.1 29.21,32.9 arc90 29.34,32.77 v31.5,32.77 | U2.1 38.11,10.15 arc-90 v37.59,10.67 | v37.34,15.49 v37.34,13.97
  Bottom 0.305: v37.59,10.67 37.59,13.72 arc90 v37.34,13.97 | v37.34,15.49 34.47,18.36 arc45 34.04,18.54 33.89,18.54 arc-45 33.27,18.8 29.72,22.35 20.07,22.35 20.07,35.31 arc-45 20.25,35.74 22.68,38.17 arc-45 23.11,38.35 24.86,38.35 arc-45 26.65,37.61 27.98,36.28 arc45 29.72,35.56 arc-90 30.73,34.54 30.73,33.53 arc90 v31.5,32.77
PIN_C  (via drill 0.35)
  Top 0.305: U2.2 arc-45 39.77,10.92 v38.61,10.92 | v35.81,32.51 arc-45 36.2,32.9 R3.1
  Bottom 0.305: v38.61,10.92 arc45 38.1,9.7 38.1,8.38 38.94,7.55 arc45 39.37,7.37 50.04,7.37 arc90 52.58,9.91 54.36,11.68 arc90 54.86,12.19 54.86,33.27 52.76,35.38 arc-45 52.58,35.81 52.58,39.62 arc90 50.8,41.4 34.83,41.4 arc45 33.04,40.66 32.26,39.88 32.26,36.61 arc45 33,34.82 34.95,32.87 arc45 v35.81,32.51
PIN_D  (via drill 0.35)
  Top 0.305: U2.9 38.44,17.25 arc45 v39.12,17.53 | v49.78,34.29 49.78,33.91 R4.1
  Bottom 0.305: v49.78,34.29 50.29,33.78 50.55,33.78 arc-45 52.78,28.39 51.09,26.7 arc-45 49.78,26.16 47.79,26.16 arc45 45.99,25.42 39.66,19.08 arc45 39.12,17.78 v39.12,17.53
PIN_E  (via drill 0.35)
  Top 0.305: U2.10 37.56,18.51 arc-90 v37.59,18.54 | R5.1 51.34,31.66 v51.31,31.5
  Bottom 0.305: v37.59,18.54 arc90 39.12,20.07 39.12,20.83 arc-90 40.64,22.35 41.4,22.35 arc90 42.93,23.88 45.23,26.18 arc-45 47.03,26.92 48.73,26.92 arc45 50.53,27.67 51.31,28.45 arc45 51.82,29.67 51.82,30.7 arc45 51.61,31.19 v51.31,31.5
PIN_F  (via drill 0.35)
  Top 0.305: v36.58,18.54 arc-45 36.76,18.1 U2.11 | v40.64,28.19 40.64,29.59 arc-90 R6.1
  Bottom 0.305: v36.58,18.54 36.58,22.1 arc-90 37.08,22.61 arc90 37.34,22.86 37.34,25.15 arc-90 39.88,27.69 40.13,27.69 arc90 v40.64,28.19
PIN_G  (via drill 0.35)
  Top 0.305: v23.88,20.83 34.04,20.83 arc-90 35.96,18.9 U2.12 | R7.1 32.35,34.08 arc-45 v32.26,34.29
  Bottom 0.305: v23.88,20.83 19.81,20.83 arc-90 19.3,21.34 19.3,35.2 arc-45 19.56,35.81 22.37,38.63 arc-45 24.17,39.37 25.15,39.37 arc-45 26.45,38.83 28.21,37.07 arc45 30.38,36.17 v32.26,34.29
POS_IN  (via drill 0.35)
  Top 0.305: v63.5,33.27 arc-90 65.53,31.24 65.53,29.97 arc90 66.42,29.08 IC1.3
  Bottom 0.305: D.E v63.5,33.27 63.4,33.17 arc45 61.23,32.28 TP3.P$1 59.21,30.26 arc45 58.67,28.96 58.67,17.02 arc90 59.31,16.39 59.44,16.39 R15.2
RESET  (via drill 0.35)
  Top 0.305: v52.83,2.54 49.02,2.54 arc90 48.77,2.29 arc-90 48.26,1.78 45.72,1.78 arc-90 44.7,2.79 44.7,3.3 arc90 v42.16,5.84 | v36.07,7.37 arc-90 35.96,7.47 U2.29 35.96,10.41 arc45 35.35,10.67 v33.78,10.67 | v57.15,12.19 arc-90 56.9,12.45 R9.1 | 25.78,11.81 arc90 v25.65,11.68 arc-90 25.78,11.81 | 25.78,11.81 C3.2
  Bottom 0.305: v52.83,2.54 J2.5 arc90 56.9,1.27 57.91,1.27 arc90 60.71,4.06 60.71,8.64 arc90 58.17,11.18 arc-90 v57.15,12.19 | v33.78,10.67 33.53,10.67 33.08,11.12 arc45 31.71,11.68 v25.65,11.68 | v42.16,5.84 38.97,5.84 arc-45 38.35,6.1 arc45 37.74,6.35 37.08,6.35 arc-90 v36.07,7.37
RX  (via drill 0.35)
  Top 0.305: J6.TXO 37.5,3.9 arc-45 36.76,5.69 U2.30 36.76,11.11 arc-90 37.08,11.43 arc90 37.59,11.94 37.59,12.7 36.25,14.04 arc45 35.81,14.22 arc-45 34.95,14.58 v34.8,14.73 | v16.76,14.48 arc90 18.29,12.95 24.13,12.95 v24.38,13.21 | U1.2 8.51,16.64 arc90 v8.38,16.76 8.38,17.02 arc90 7.11,18.29 5.23,18.29 arc-90 RX.C
  Bottom 0.305: v34.8,14.73 33.93,15.6 arc45 33.57,15.75 26.88,15.75 arc45 25.65,15.24 24.92,14.51 arc45 v24.38,13.21 | v16.76,14.48 16,14.48 arc-90 15.75,14.73 15.75,15.49 arc90 13.21,18.03 9.65,18.03 arc90 v8.38,16.76
SCK  (via drill 0.35)
  Top 0.305: IC3.7 13.56,38.47 arc45 13.72,38.1 v17.02,38.1 | U2.17 arc90 U2.17 arc-90 U2.17 | U2.17 31.49,15.75 arc-90 v32.77,14.48 | v25.4,12.7 arc45 25.04,13.57 24.89,13.72 arc45 24.28,13.97 24.13,13.97 arc-45 22.9,13.46 19.3,13.46 arc-90 v18.54,14.22 arc-90 18.29,14.48 R16.2
  Bottom 0.305: J3.4 arc-90 31.5,5.08 34.78,4.84 | 34.78,4.84 35.05,4.83 49.78,4.83 arc-90 50.04,5.08 J2.3 | 34.78,4.84 34.78,9.76 arc-45 35.05,10.41 35.05,10.82 arc45 34.8,11.43 34.8,12.45 arc90 v32.77,14.48 27.18,14.48 arc90 v25.4,12.7 | v18.54,14.22 18.54,14.99 arc90 18.03,15.49 arc-90 17.02,16.51 v17.02,38.1
SCL  (via drill 0.35)
  Top 0.305: v33.27,9.91 35.05,9.91 arc-90 35.16,9.8 U2.28
  Bottom 0.305: v33.27,9.91 33.27,9.65 arc-90 31.24,7.62 26.92,7.62 arc90 26.16,6.86 26.16,1.78 arc-90 25.65,1.27 20.07,1.27 arc-90 J1.2 18.29,6.73 arc-90 R11.1
SD_CS  (via drill 0.35)
  Top 0.152: 5.58,27.7 v5.59,27.69
  Top 0.305: IC3.10 13.56,44.04 arc-90 11.68,42.16 8.13,42.16 arc90 v5.59,39.62 | MICROSD.CS 5.58,27.7
  Bottom 0.305: v5.59,27.69 v5.59,39.62
SD_D_IN  (via drill 0.35)
  Top 0.305: MICROSD.DATA_IN 6.95,28.8 arc90 v7.11,28.96 | v11.68,38.35 arc-90 11.61,38.42 IC3.4
  Bottom 0.305: v7.11,28.96 7.11,30.99 arc-90 8.38,32.26 9.14,32.26 arc90 11.68,34.8 v11.68,38.35
SD_D_OUT  (via drill 0.35)
  Top 0.152: IC3.3 10.96,40.94 v11.18,41.15
  Top 0.305: MICROSD.DATA_OUT 9.58,33.2 arc90 v9.91,33.53 | v10.92,38.35 10.92,39.71 arc-90 IC3.3
  Bottom 0.305: v9.91,33.53 9.91,34.8 arc90 10.92,35.81 v10.92,38.35 | v11.18,41.15 17.27,41.15 arc-90 17.53,40.89 arc90 17.78,40.64 21.59,40.64 arc45 22.46,41 arc45 23.11,42.59 23.11,44.96 arc-90 24.01,45.85 R8.1
SD_SCLK  (via drill 0.35)
  Top 0.305: MICROSD.SCLK v10.4,31 arc-90 v10.41,30.99 | v12.95,38.35 12.95,39.71 arc90 IC3.6
  Bottom 0.305: v10.41,30.99 arc90 12.95,33.53 v12.95,38.35
SDA  (via drill 0.35)
  Top 0.305: U2.27 34.54,8.48 v34.54,1.52
  Bottom 0.305: R10.2 arc90 15.75,7.74 J1.1 arc90 18.03,0.76 33.78,0.76 arc90 v34.54,1.52
SS  (via drill 0.35)
  Top 0.305: U2.14 arc-90 34.29,17.32 34.29,18.03 arc90 34.04,18.29 v30.48,18.29 | IC3.9 16,45.59 arc-90 18.54,43.05 v18.54,38.1
  Bottom 0.305: J3.1 22.35,15.75 arc-90 24.89,18.29 | 24.89,18.29 v30.48,18.29 | v18.54,38.1 18.54,37.7 arc-45 18.29,37.08 18.29,20.83 arc90 20.83,18.29 24.89,18.29
TX  (via drill 0.35)
  Top 0.305: U2.31 37.56,5.67 arc45 v37.59,5.59 | J6.RXI 35.81,5.59 arc-90 v35.56,5.84 | v20.83,21.59 17.27,21.59 arc-45 16.84,21.77 16.69,21.92 arc45 16.26,22.1 14.73,22.1 arc90 14.22,21.59 14.22,20.32 arc-90 13.46,19.56 12.95,19.56 arc90 v12.45,19.05 | U1.3 9.78,18.41 arc90 v9.4,18.8 7.62,18.8 arc-90 6.1,20.32 arc90 5.33,21.08 TX.C
  Bottom 0.305: v37.59,5.59 35.81,5.59 v35.56,5.84 35.31,6.1 35.31,7.62 35.56,7.87 35.56,11.43 35.57,11.42 arc45 35.39,11.86 35.31,11.94 35.31,14.22 arc-90 35.56,14.48 35.56,15.24 arc90 35.31,15.49 29.46,21.34 arc45 28.85,21.59 v20.83,21.59 | v12.45,19.05 9.65,19.05 arc90 v9.4,18.8
USB_VCC  (via drill 0.35)
  Top 0.305: JP2.3 21.46,42.88 arc-45 21.34,42.93 18.02,46.25 arc45 16.22,46.99 2.39,46.99 arc45 1.78,46.74 1.76,46.72 arc45 1.02,44.92 v1.02,41.66 | U$4.1 5.56,14 arc-90 4.06,15.49 4.06,16.76 arc90 3.3,17.53 0.76,17.53 v0.76,22.61
  Bottom 0.305: v0.76,22.61 arc90 2.03,23.88 2.03,37.34 arc-90 1.02,38.35 v1.02,41.66
V3  (via drill 0.35)
  Top 0.305: JP6.2 v21.59,31.24 | U1.4 arc-90 10.41,16.12 10.41,19.05 arc-90 11.18,19.81 12.19,19.81 arc90 12.45,20.07 12.7,20.07 arc90 12.95,20.32 12.95,21.84 arc-90 13.21,22.1 13.72,22.1 arc90 13.97,22.35 arc-90 14.22,22.61 20.57,22.61 arc90 v21.08,23.11
  Bottom 0.305: v21.08,23.11 21.08,30.73 arc-90 v21.59,31.24
V_POS  (via drill 0.35)
  Top 0.305: v68.07,32.51 68.07,36.32 arc-90 68.33,36.58 arc90 68.48,36.73 68.48,39.12 JP4.2 | v61.47,25.65 arc90 62.17,26.36 IC1.8
  Bottom 0.305: R14.2 61.72,23.24 61.72,25.4 v61.47,25.65 61.47,25.94 arc-90 TM1.3 arc45 64.01,28.45 v68.07,32.51 68.07,35.56 arc90 67.06,36.58 61.47,36.58 arc90 60.96,36.07 D.C
VCC  (via drill 0.35)
  Top 0.305: J.1 60.49,8.89 arc45 58.69,8.15 J2.2 arc90 56.9,6.35 56.9,2.54 arc-90 55.37,1.02 42.93,1.02 arc-90 J6.VCC | 34.54,42.67 arc90 36.07,41.15 53.85,41.15 arc-90 v56.39,38.61 arc-90 59.18,41.4 64.26,41.4 65.63,41.4 arc-90 JP4.1 | 34.54,42.67 arc90 33.53,43.69 JP2.2 21.84,43.69 arc-90 v21.08,44.45 | U2.18 30.51,14.95 arc-90 29.97,15.49 29.97,17.78 29.72,18.29 29.72,19.3 arc90 28.96,20.07 | 34.54,42.67 34.54,42.16 arc-90 33.53,41.15 25.53,41.15 arc90 22.99,38.61 R20.2 R19.2 | 38.35,12.85 v38.35,11.68 | v50.29,13.46 50.29,13.72 arc-90 52.83,16.26 53.85,16.26 arc90 v56.39,18.8 56.39,16.89 arc90 R9.2 | 28.96,20.07 16.83,20.07 arc45 14.99,19.3 14.37,18.69 arc45 14.22,18.33 v14.22,16.76 22.22,16.76 arc90 C16.2 | R18.1 arc90 24.76,31.24 arc-90 24.64,31.37 24.64,33.78 arc90 24.13,34.29 R19.2 | 28.96,20.07 v34.29,20.07 | 39.16,14.15 arc-90 38.35,14.96 v38.35,15.49 | JP5.3 arc90 21.59,33.58 21.59,33.78 arc-90 22.1,34.29 R19.2
  Top 0.406: U2.6 39.16,14.15 arc45 38.1,13.72 38.1,12.95 38.35,12.85 arc45 39.07,12.55 U2.4
  Bottom 0.305: J.1 59.62,12.77 arc-45 59.44,13.21 arc45 58.98,14.3 57.09,16.19 arc-45 56.39,17.88 v56.39,18.8 v56.39,38.61 | J5.2 11.18,7.87 TP1.P$1 arc-90 11.18,8.38 11.18,10.41 | v14.22,16.76 14.22,16.51 arc-90 12.19,14.48 arc90 11.18,13.46 11.18,10.41 | v38.35,11.68 39.62,11.68 arc-90 40.39,10.92 arc90 41.91,9.4 47.75,9.4 arc90 50.29,11.94 v50.29,13.46 | IC2.1 16.32,43.5 arc90 16.51,43.69 16.51,45.21 arc90 16.32,45.4 IC2.3 arc-90 16.29,46.23 18.8,46.23 arc-90 19.3,45.72 arc90 20.57,44.45 v21.08,44.45 C9.1 | JP1.2 11.18,10.41 | v34.29,20.07 35.38,18.98 arc-45 35.74,18.11 v38.35,15.49
VCC_JP5
  Top 0.305: U1.16 arc-90 9.01,22.86 13.46,22.86 arc-90 13.72,23.11 16.51,23.11 arc90 17.53,24.13 arc-90 18.54,25.15 19.94,25.15 arc90 C15.1 arc90 19.68,25.91 14.48,25.91 arc-90 11.94,28.45 11.94,30.48 arc-90 12.7,31.24 JP5.2
VDD  (via drill 0.35)
  Top 0.203: MICROSD.VDD 4.12,29.97
  Top 0.305: 4.12,29.97 v6.35,29.97 | IC3.1 arc-90 9.53,39.62 v8.38,39.62 | v12.7,30.23 arc-90 12.9,30.43 JP5.1 JP6.3
  Bottom 0.203: R8.2 24.89,43.05 | 18.06,43.18 18.06,43.43 IC2.5 | 8.38,42.8 8.32,42.86 C11.1
  Bottom 0.305: 18.06,43.18 18.06,42.2 arc45 18.29,41.66 arc45 18.9,41.4 20.57,41.4 arc45 22.31,42.12 22.35,42.16 22.35,45.51 arc-45 22.86,46.74 arc-45 23.47,46.99 25.91,46.99 arc-90 26.42,46.48 26.42,43.94 arc-90 25.52,43.05 R8.2 | C11.1 arc90 9.27,41.91 16.54,41.91 arc90 18.06,43.43 | TP7.P$1 arc-45 25.58,42.36 24.89,43.05 | 8.32,42.86 arc-90 8.38,42.8 v8.38,39.62 arc90 6.35,37.59 v6.35,29.97 6.35,28.96 arc90 7.37,27.94 8.64,27.94 arc90 9.14,28.45 9.14,29.46 arc-90 9.91,30.23 v12.7,30.23
X0
  Top 0.305: C13.2 arc90 17.91,12.19 16.78,12.19 arc-90 Y2.3 15.91,15.27 arc90 U1.8
XI
  Top 0.305: C12.2 arc90 11.67,11.32 Y2.1 14.11,11.32 arc90 14.73,11.94 14.73,15.36 arc-90 U1.7
XTAL1
  Top 0.305: 40.87,14.95 U2.7
  Top 0.406: Y1.1 41.98,14.49 arc-45 41.4,14.73 arc45 40.87,14.95 | Q1.1 Y1.1 | Y1.1 45.77,14.49 arc-45 R13.2 C2.1
XTAL2
  Top 0.406: U2.8 40.19,15.75 arc45 41.4,16.26 arc-45 41.98,16.49 Y1.3 | Y1.3 arc-45 44.15,16.89 R13.1 C1.1 | Y1.3 Q1.2

### Text on the board
tNames: 9V GND | [ ]T_9V | + | LED resistors | 7 segment LED resistors | 5v [ ] / / 3.3v [ ] | <= Only if no 3.3V (VDD) / available | - / / + | T_CD / [ ] / #2 / / / / / / / / / [ ] #1 | + / / - | https://github.com/konradwilk/ / wash-hand-pcb | # / [ ] / [ ] / [ ] / [ ] / [ ] / [ ] / [ ] / [ ] / [ ] / [ ] / [ ] / ASBLY | - / - | Line sensor | SCK | RST SCK MISO / GND MOSI VCC | RST | 5V 500 mA | GND VCC | SDA SCL | SS MISO MOSI SCK | VCC GND D0 | RST TX RX VCC CTS GND
bNames: GND 9V | [ ] 3.3V | Copyright 2020 by / Konrad Rzeszutek Wilk | IR_D / [ ] / / [ ] / IR_E | 5V 500 mA | VCC [ ] | v1.4-rc5 | D0 GND VCC